# EasyEDA Pro project ProPrj_103-HQU15集成板_Vel2.0.epro, schematic Schematic1

## Sheets
1 核心板外围电路: Board Name: 信号板; Create Date: 2025-02-23; Page Name: 核心板外围电路; Project Name: 103-HQU15集成板-第二版; Schematic Name: Schematic1; Update Date: 2025-02-24; Company: 嘉立创EDA; Page Size: A4; Version: V1.0
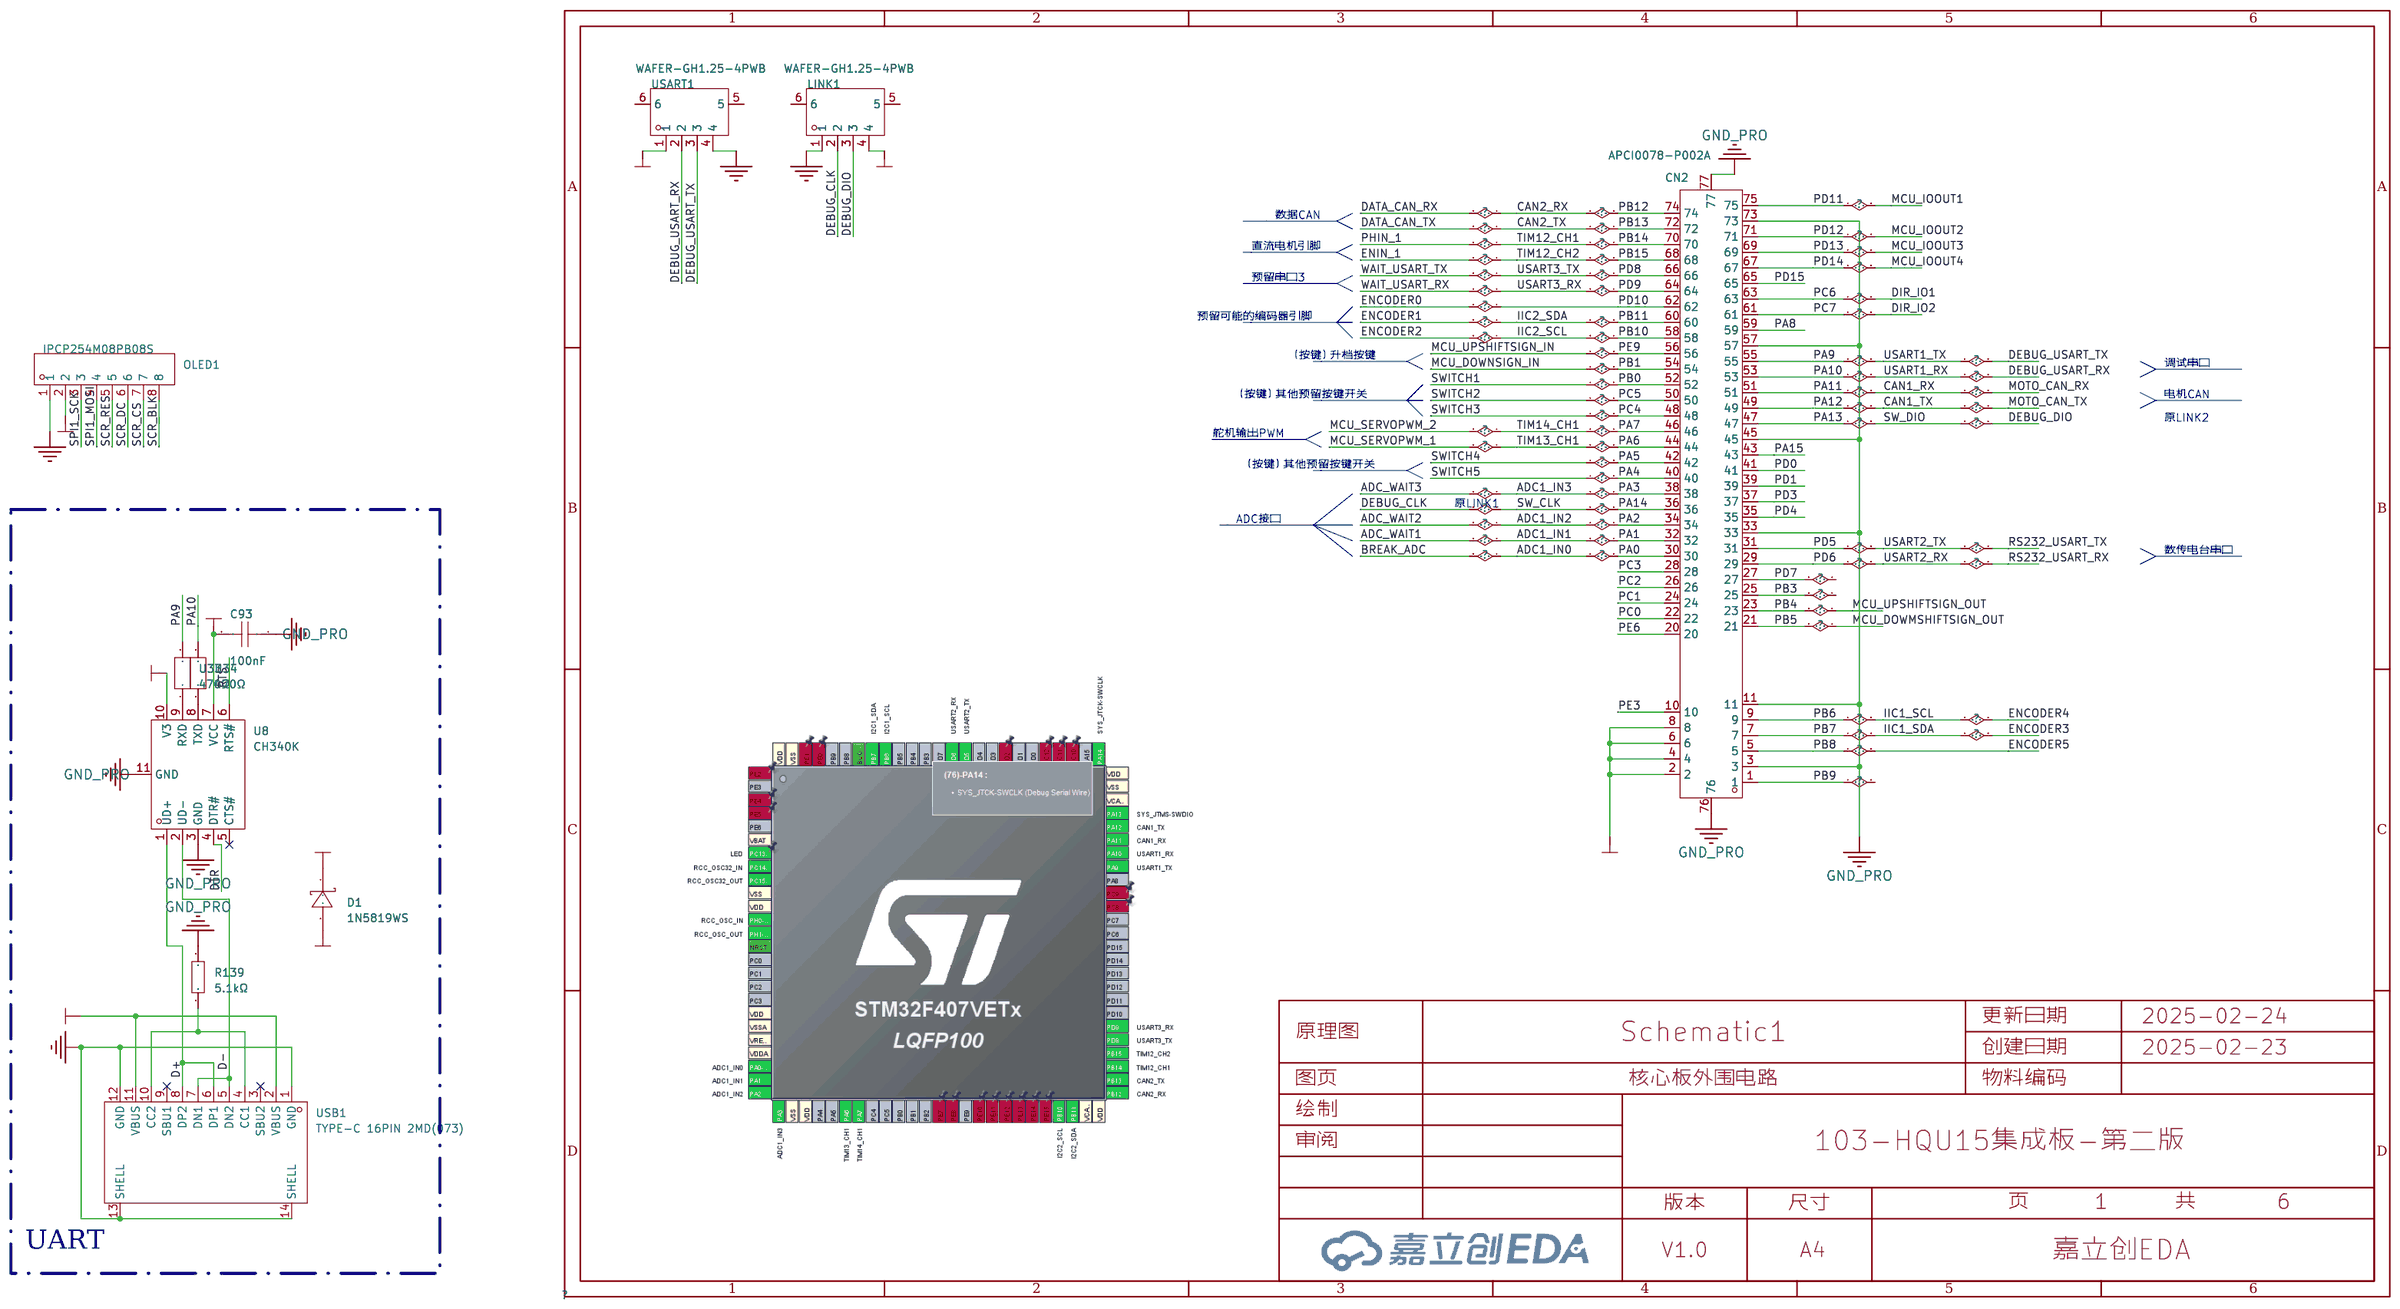
[diagram p0: 核心板外围电路]
2 电源: Page Name: 电源
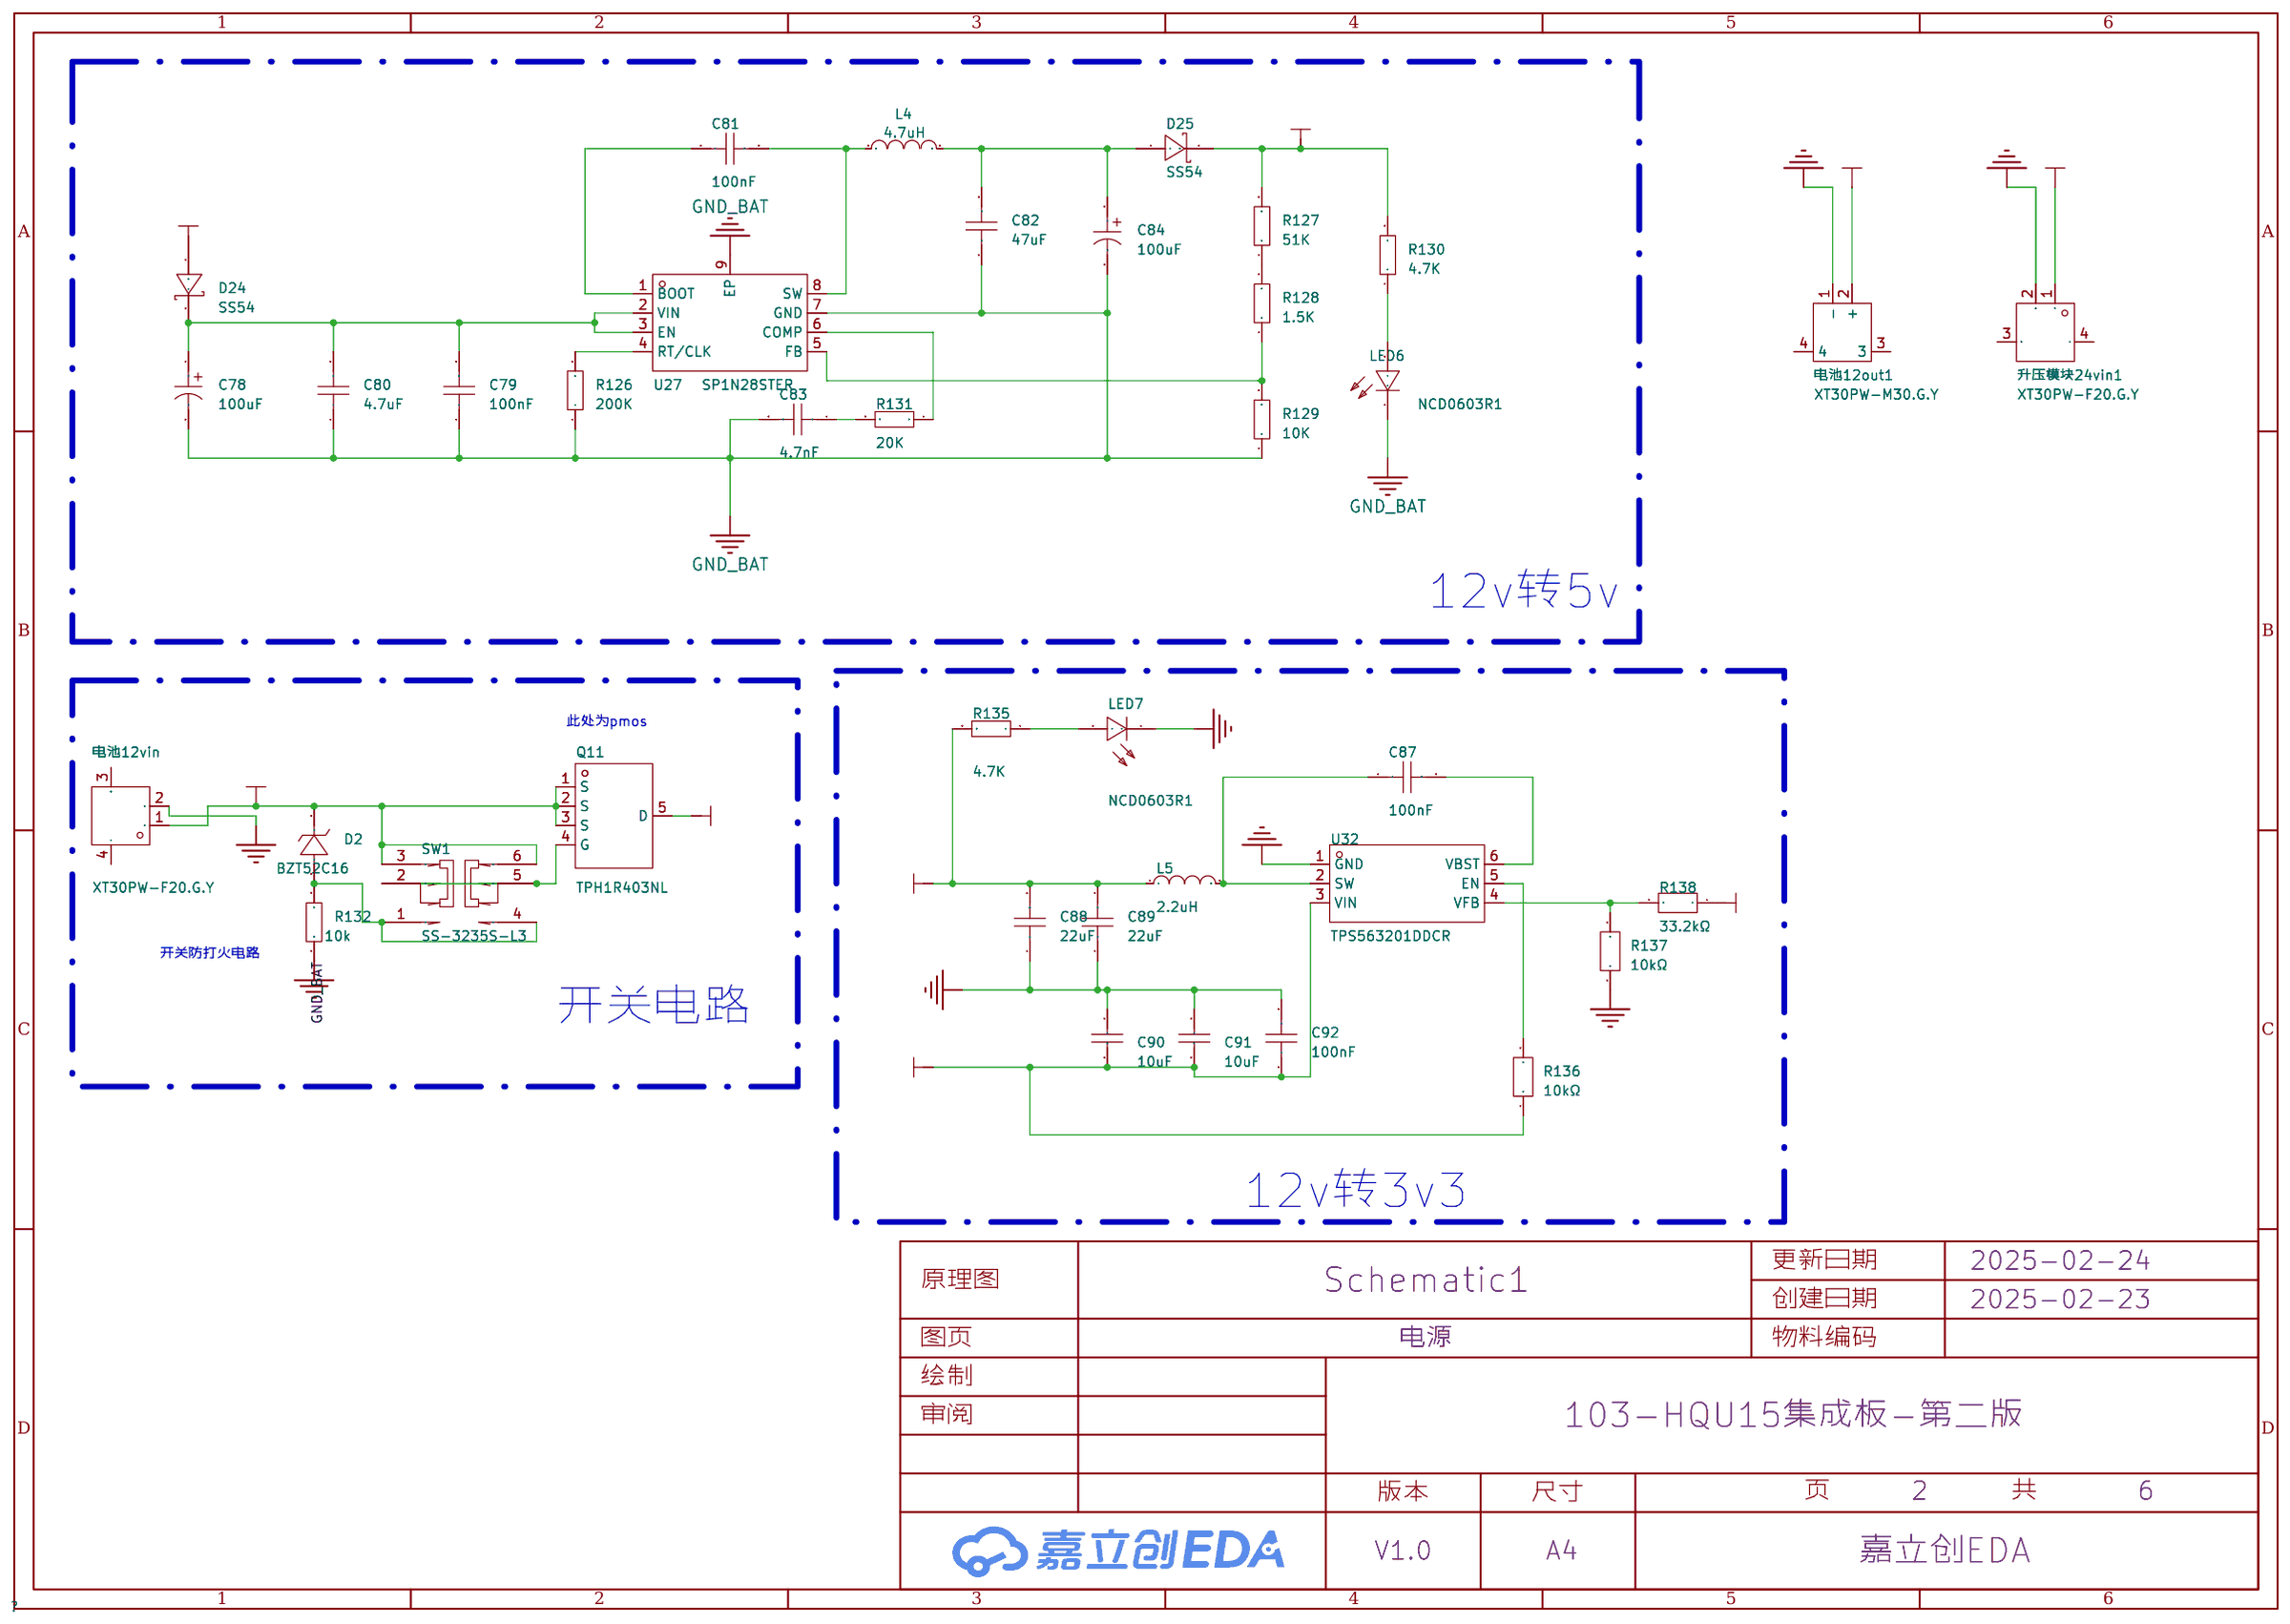
[diagram p1: 电源]
3 保护电路: Page Name: 保护电路
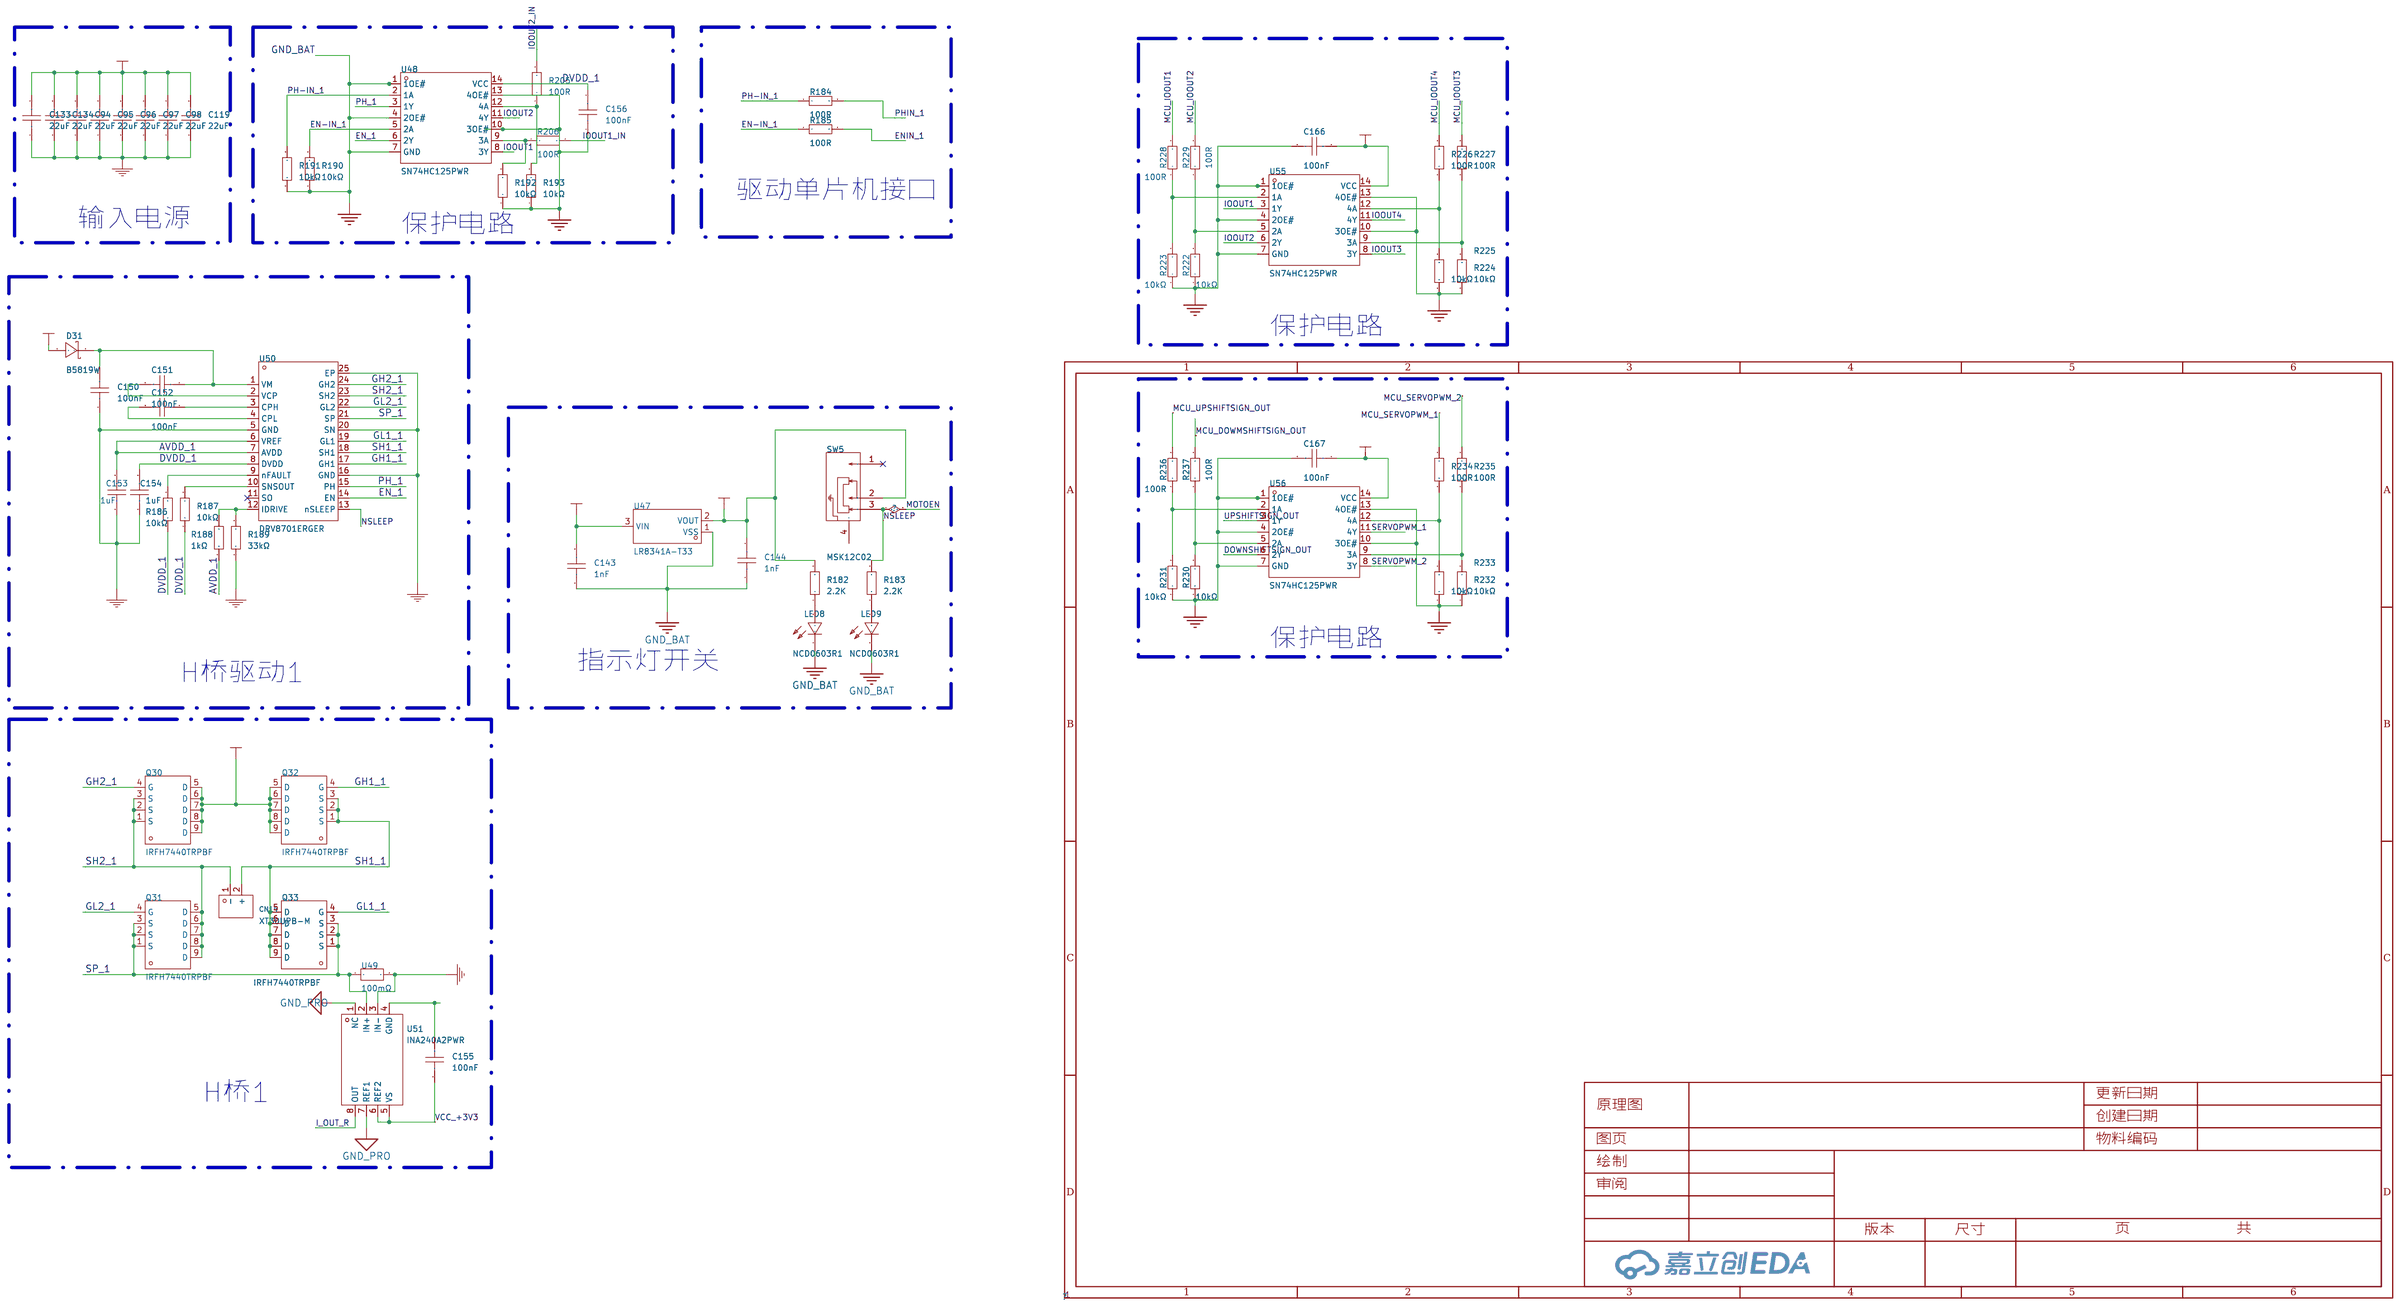
[diagram p2: 保护电路]
4 交互: Page Name: 交互
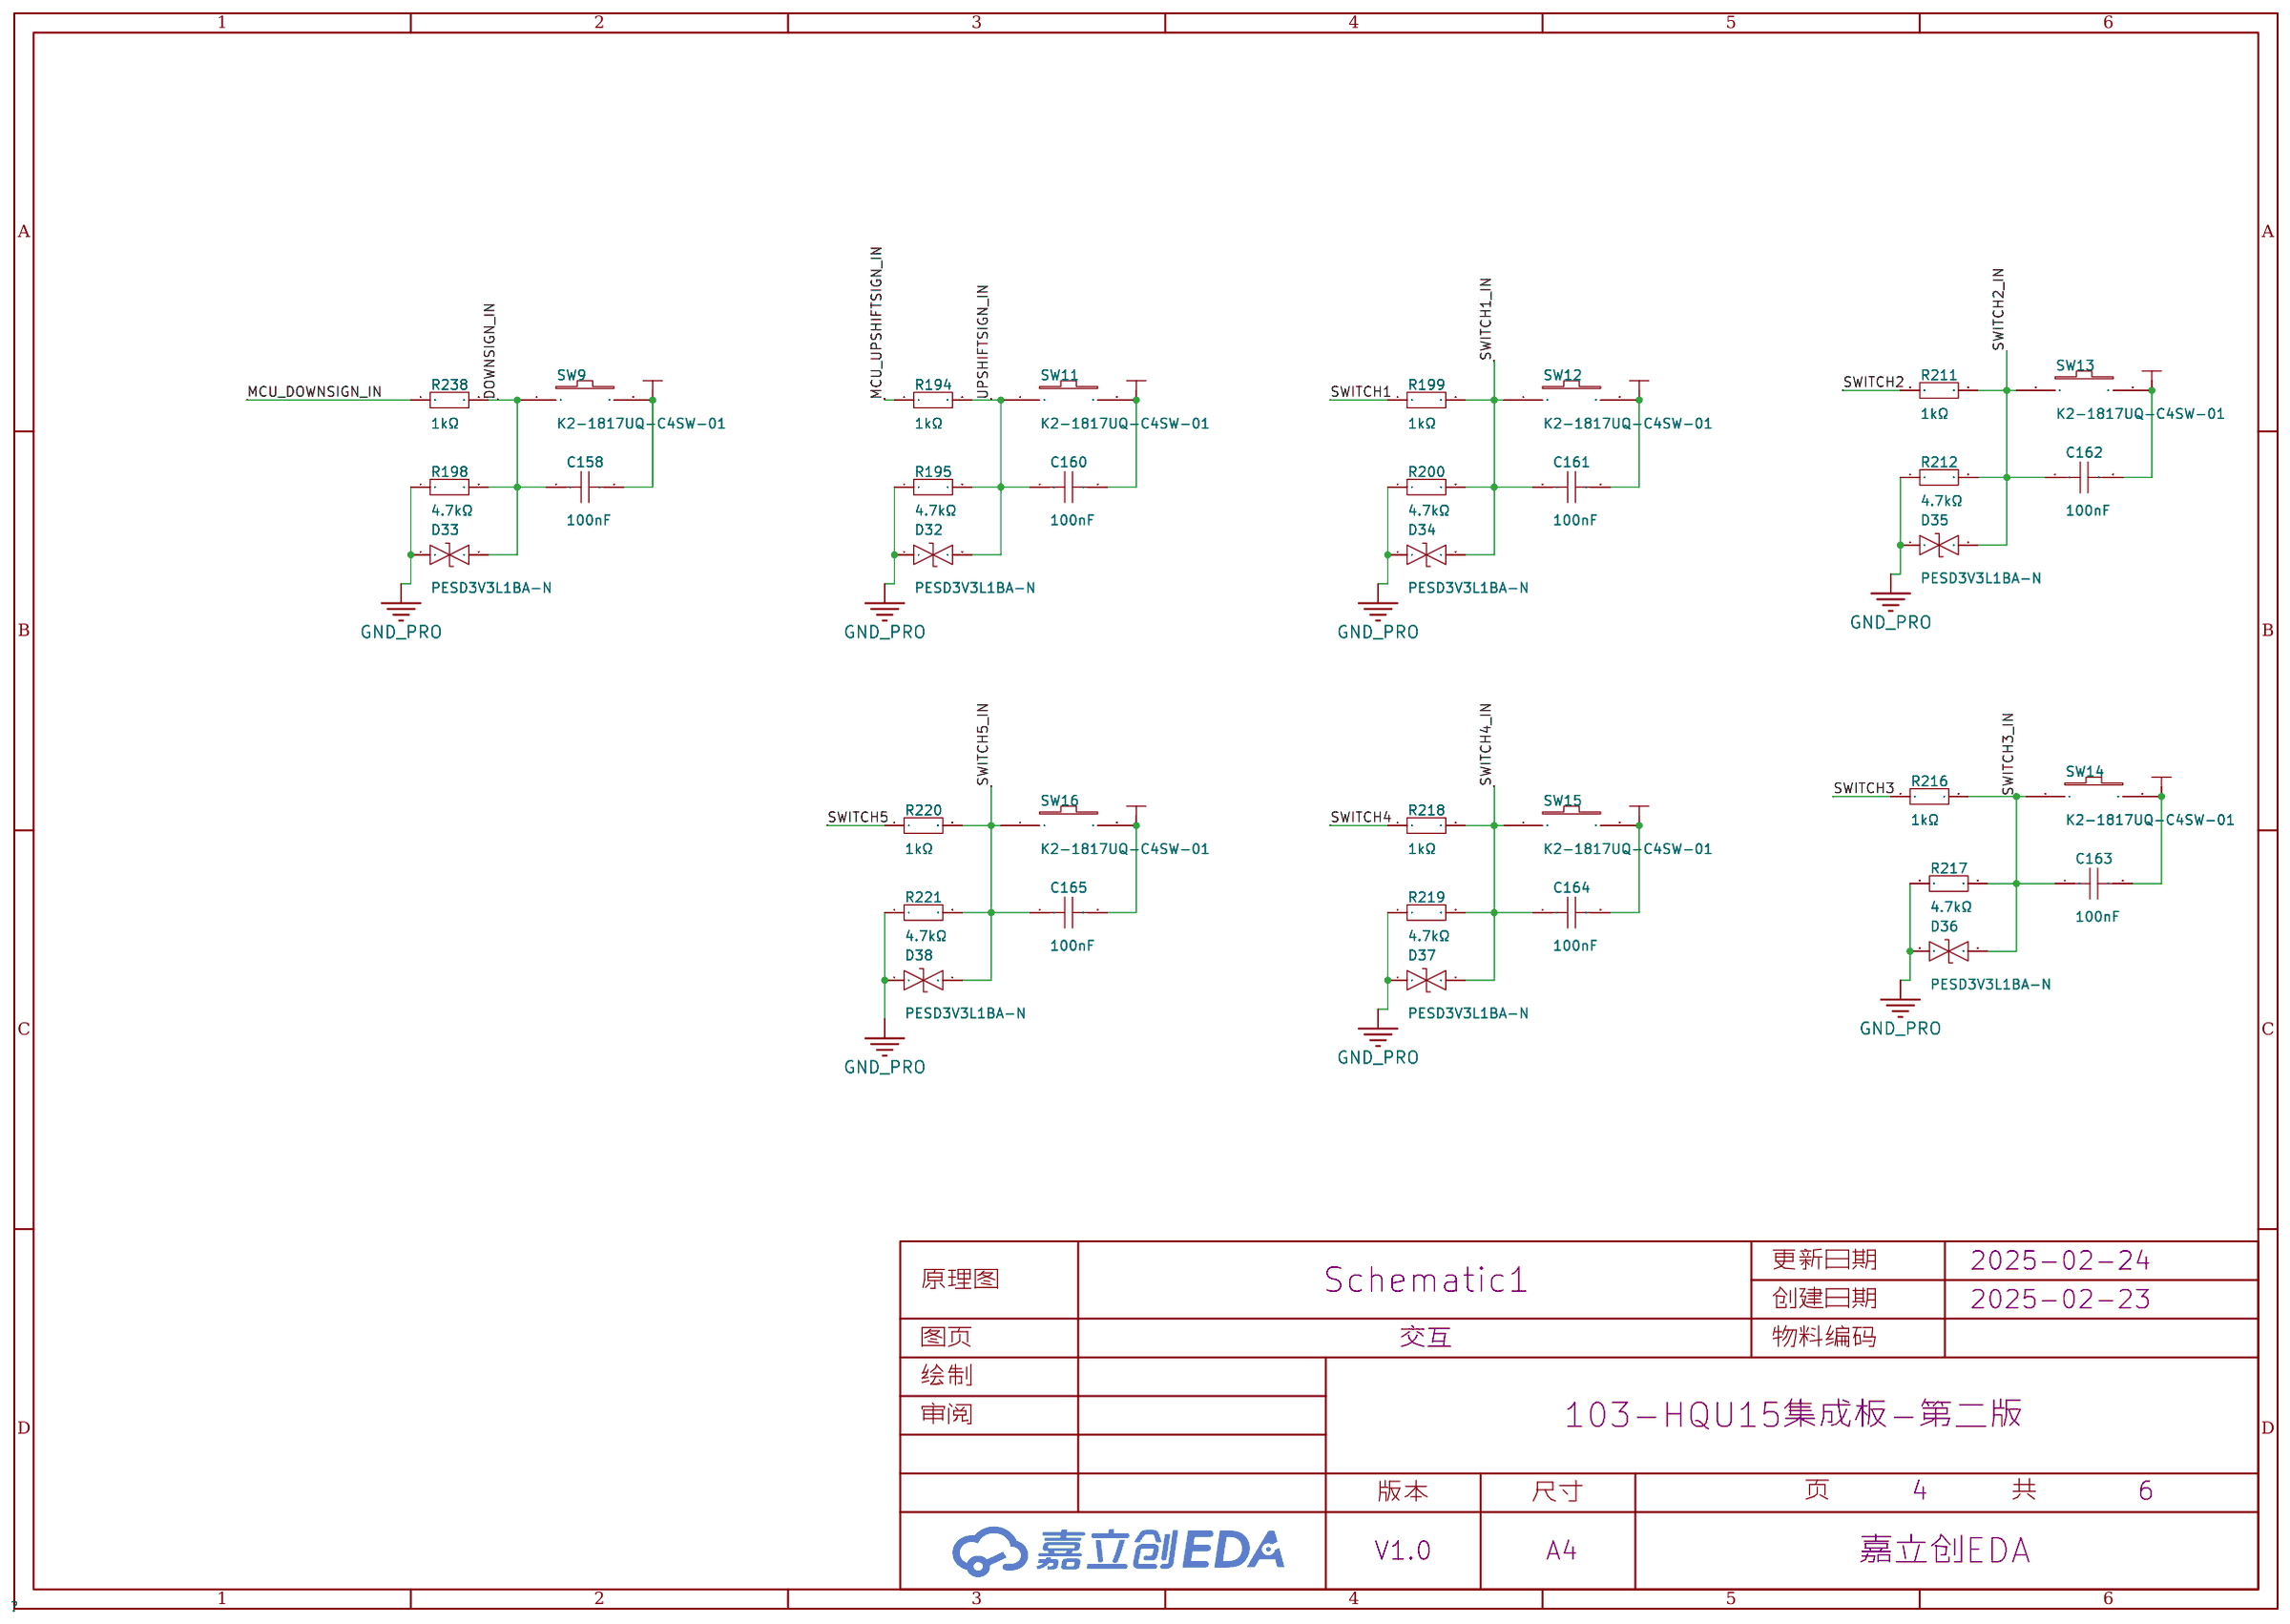
[diagram p3: 交互]
5 无线数传部分: Page Name: 无线数传部分; Update Date: 2025-02-25
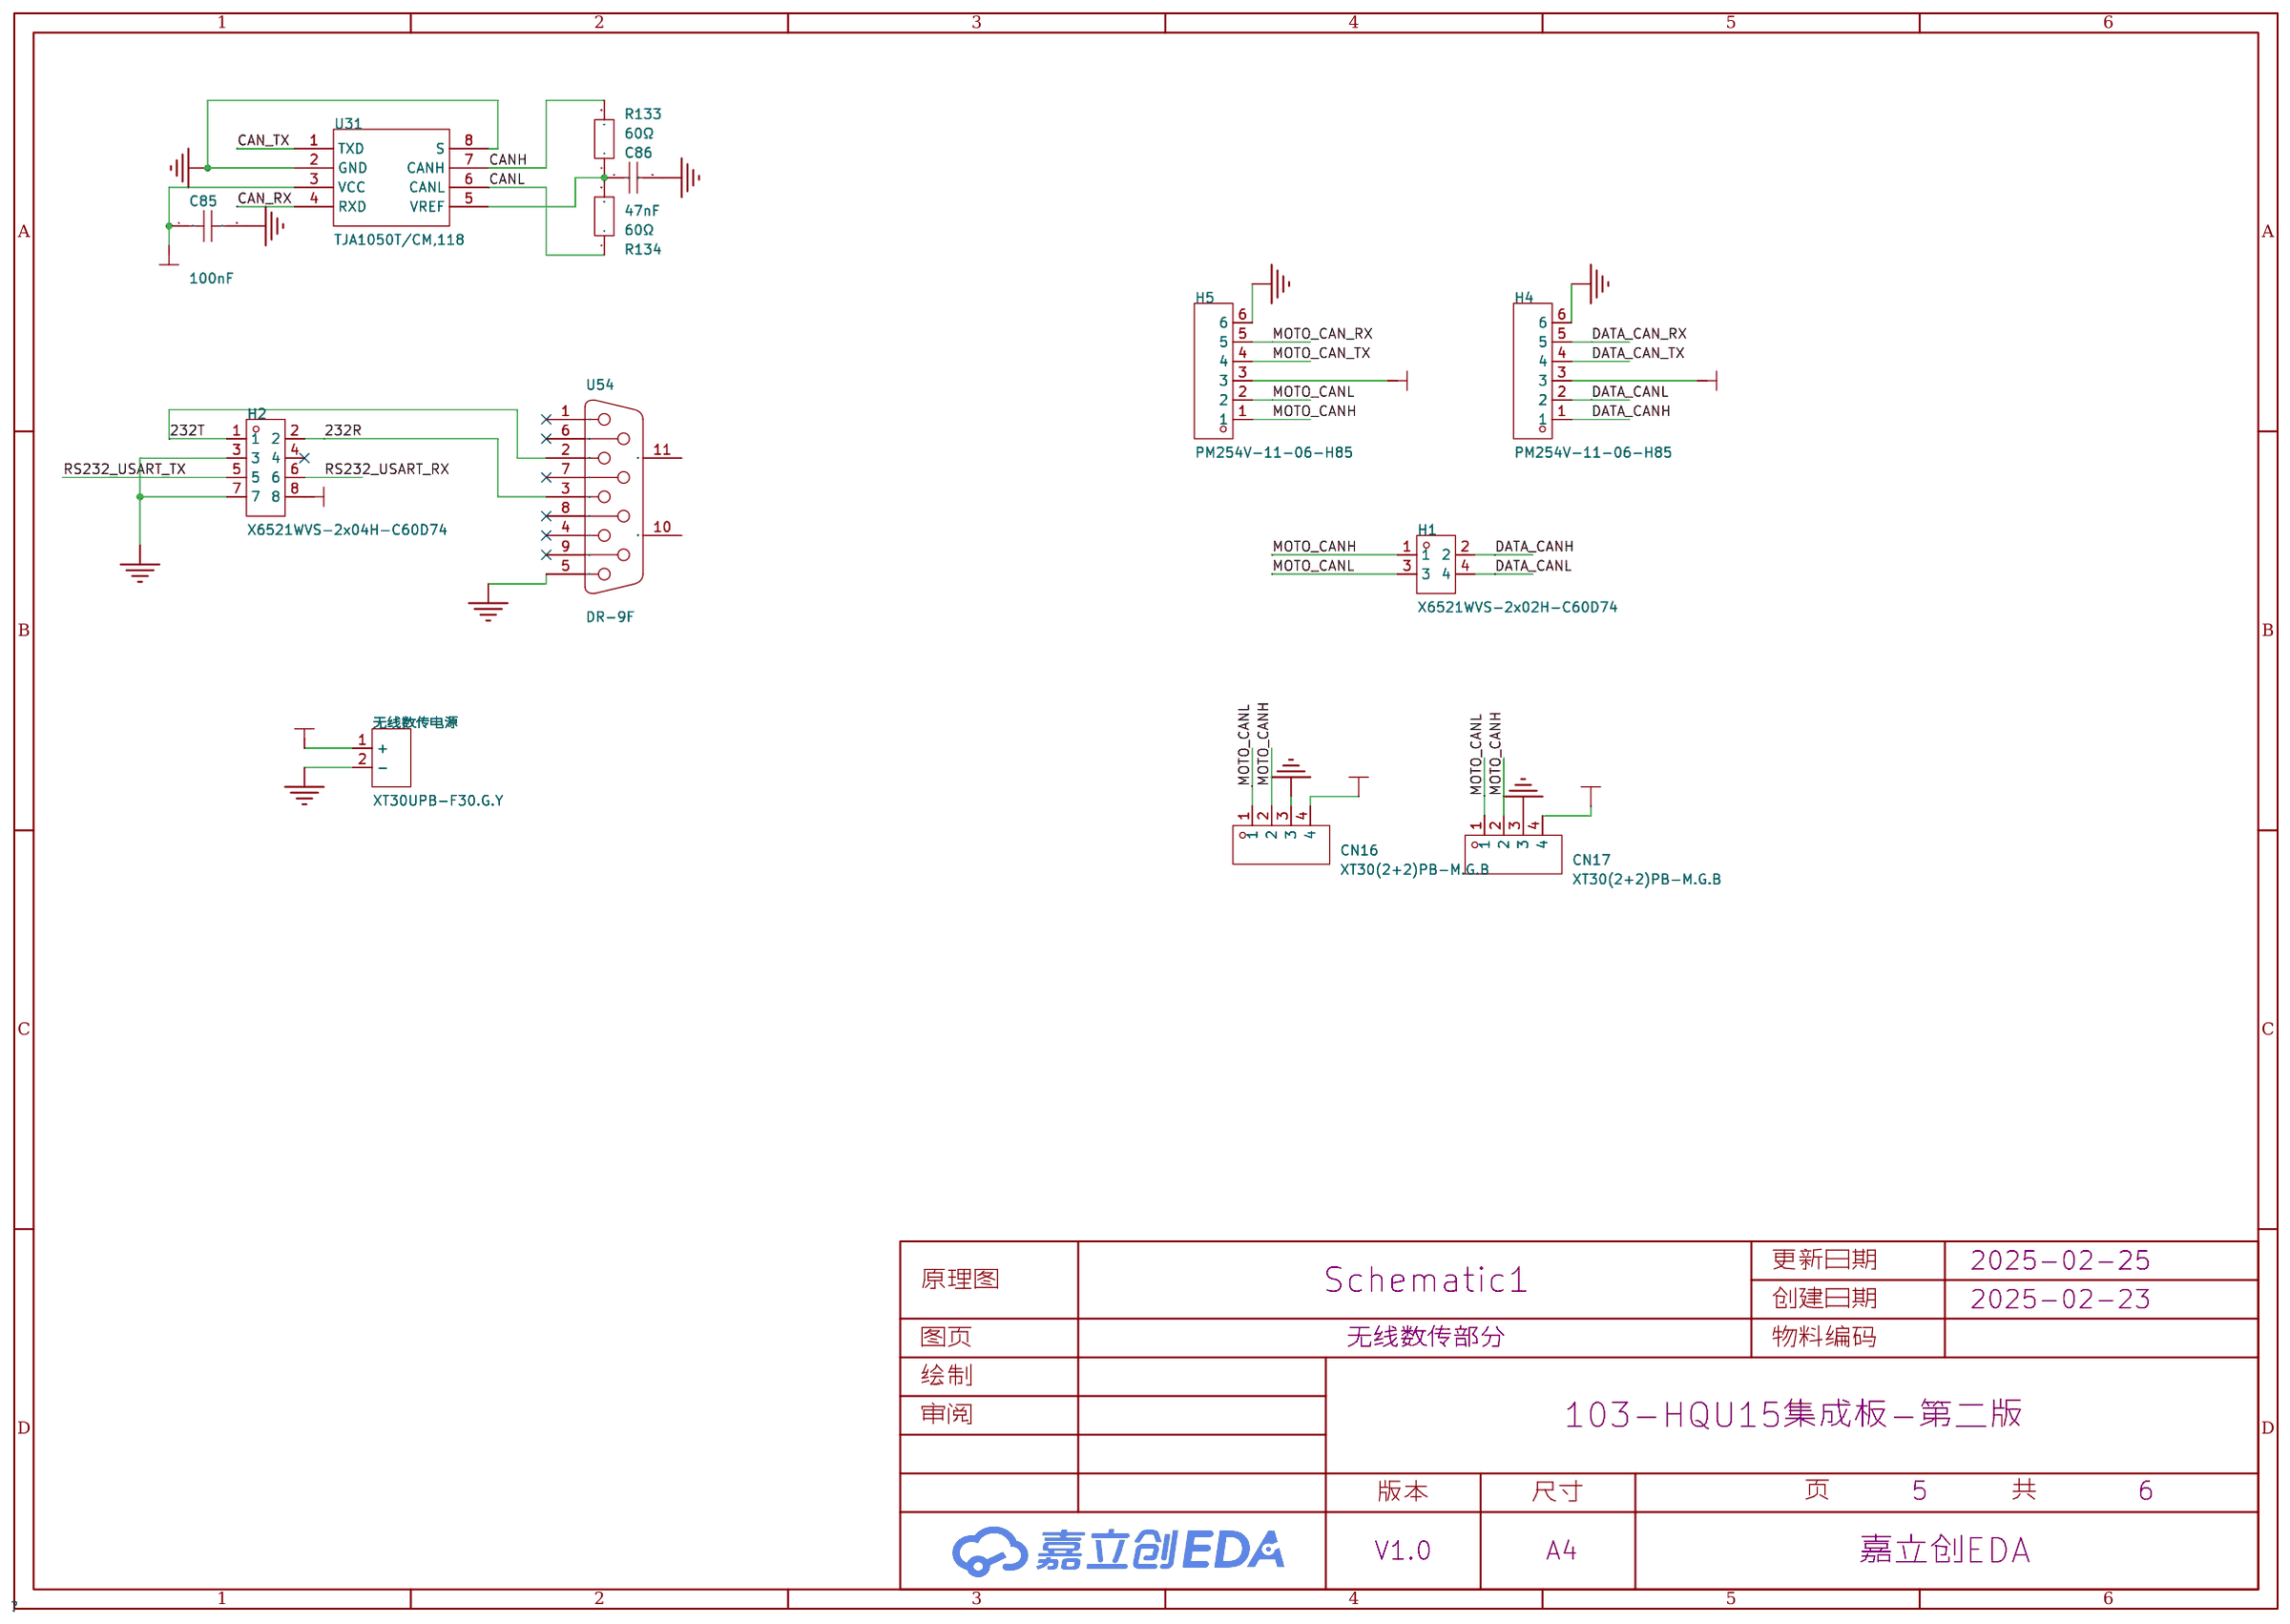
[diagram p4: 无线数传部分]
6 主要接口及其他: Page Name: 主要接口及其他
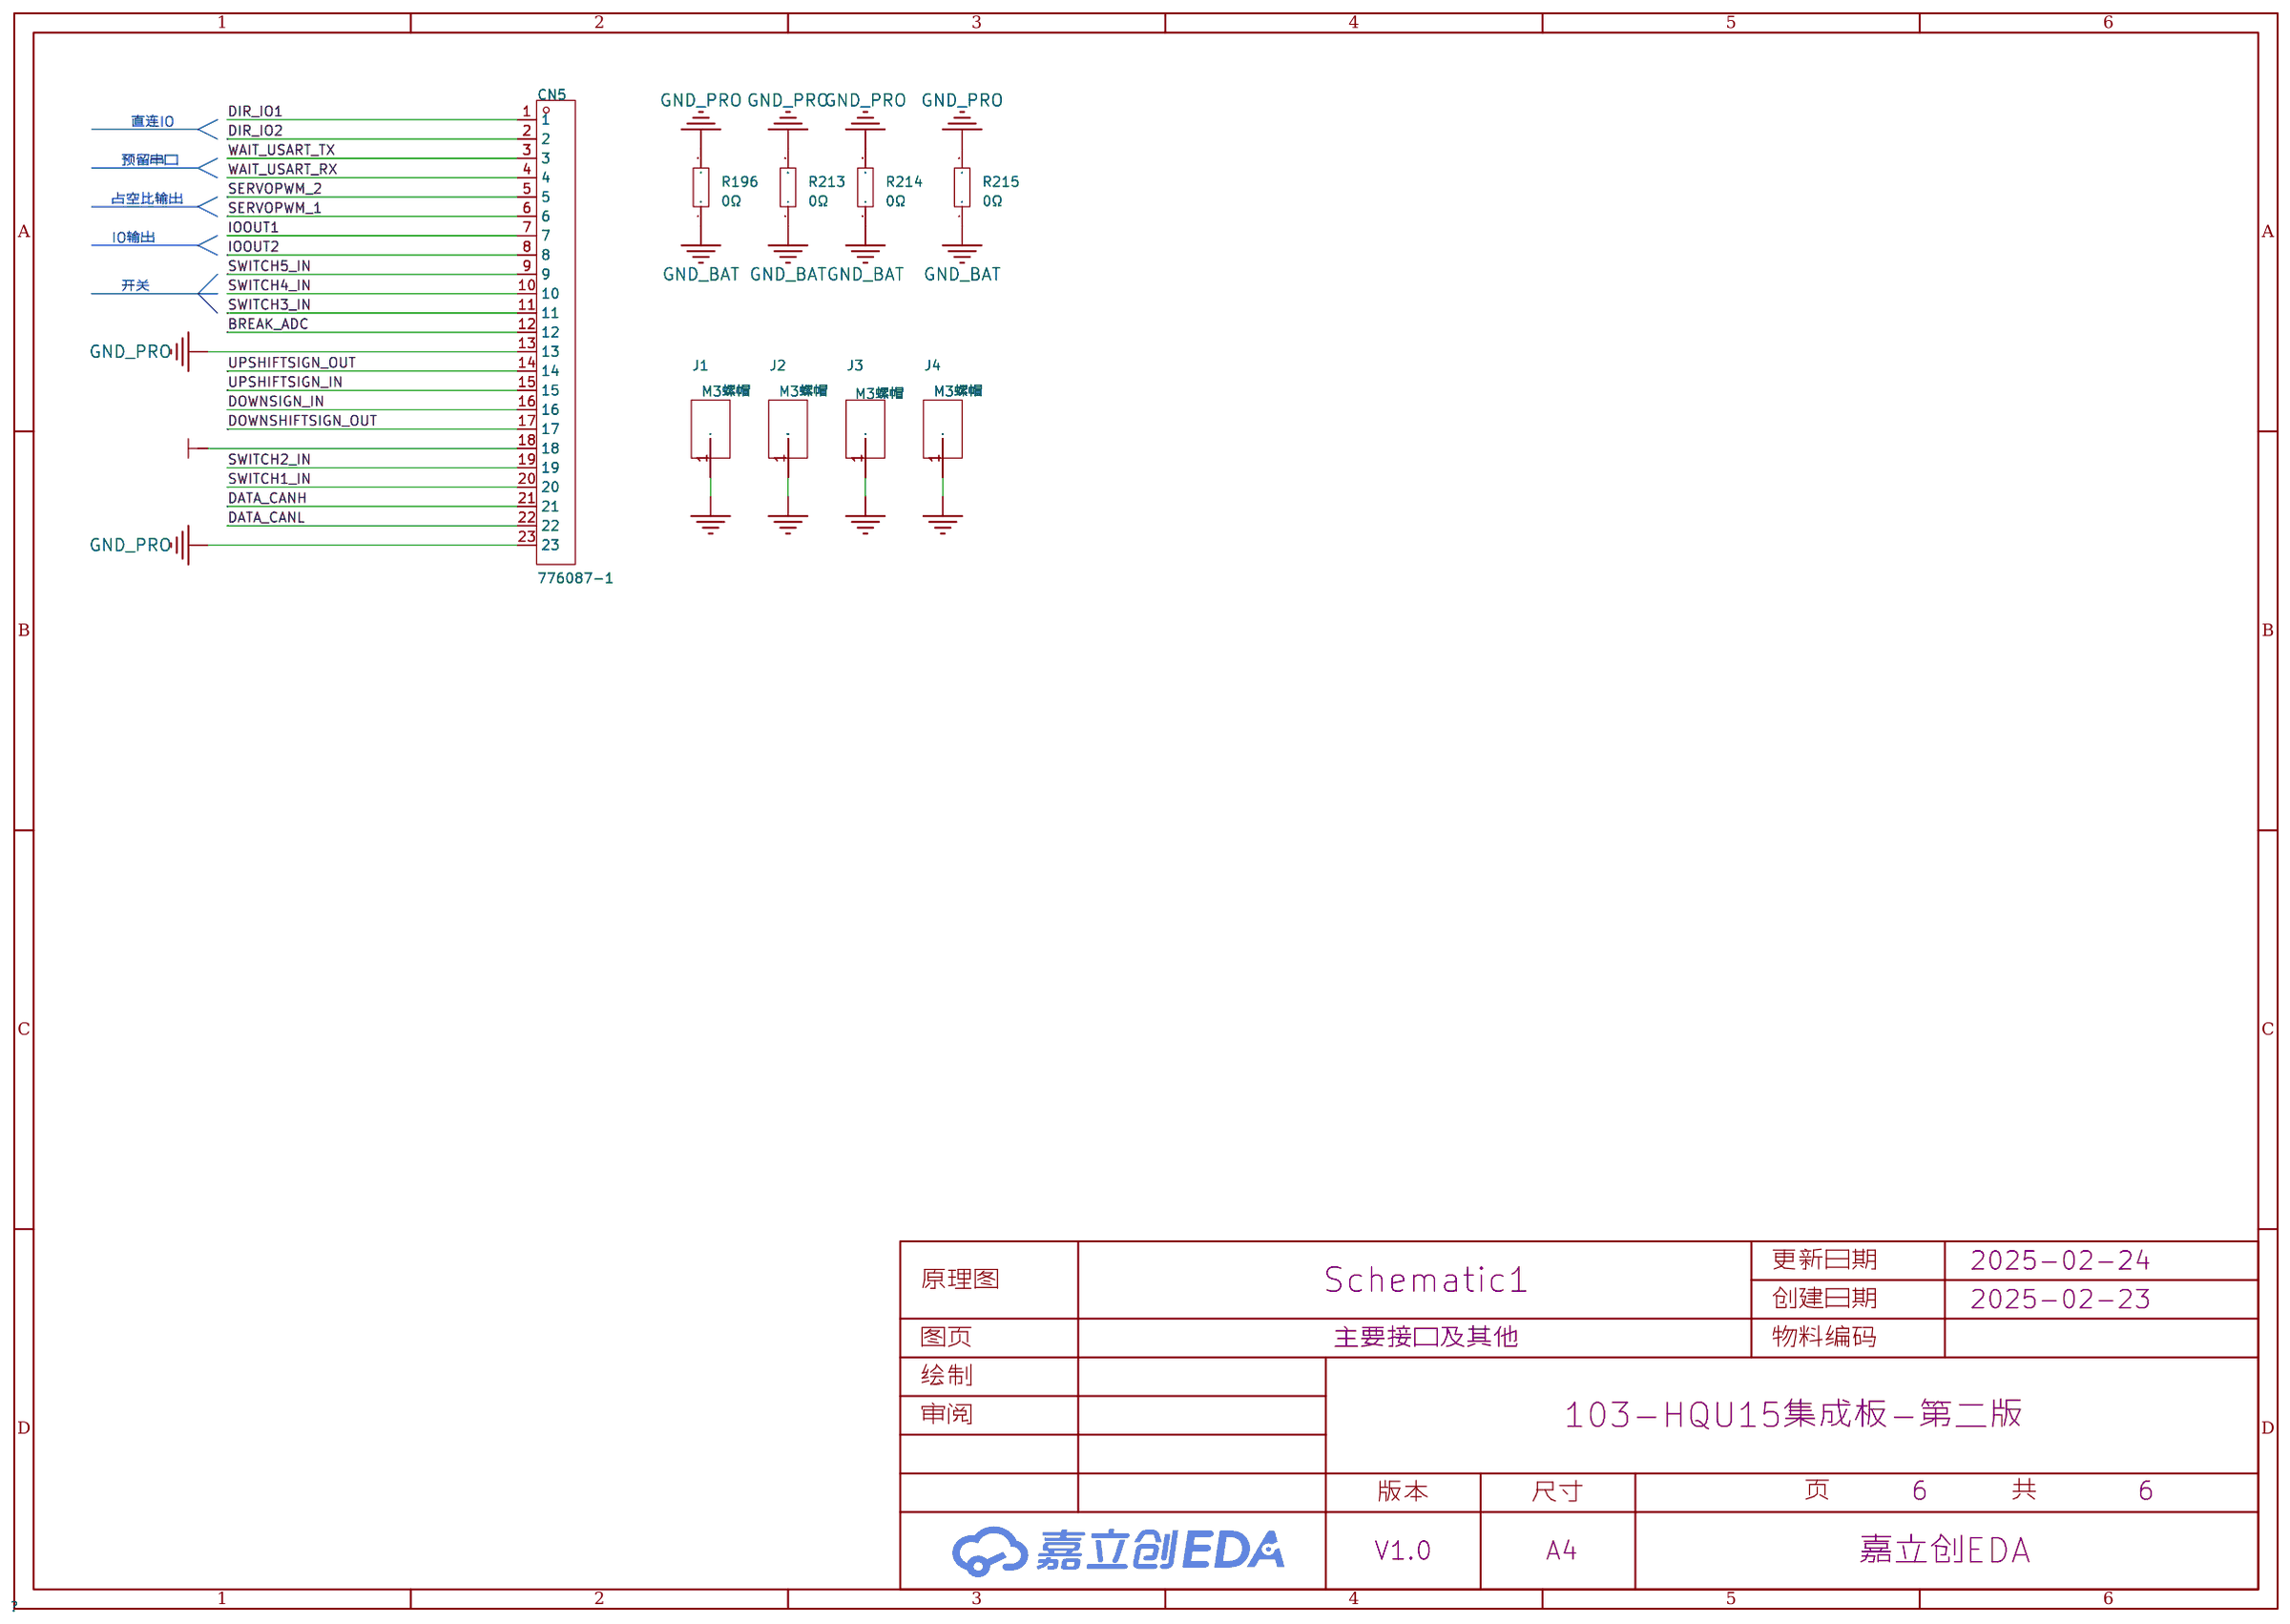
[diagram p5: 主要接口及其他]

## Parts
sheet 主要接口及其他
CN5  776087-1  [CONN-TH_776087-1]
J1  M3螺帽  [M3螺帽]
J2  M3螺帽  [M3螺帽]
J3  M3螺帽  [M3螺帽]
J4  M3螺帽  [M3螺帽]
R196  0Ω  [R0805]
R213  0Ω  [R0805]
R214  0Ω  [R0805]
R215  0Ω  [R0805]
sheet 交互
C158  100nF  [C0603]
C160  100nF  [C0603]
C161  100nF  [C0603]
C162  100nF  [C0603]
C163  100nF  [C0603]
C164  100nF  [C0603]
C165  100nF  [C0603]
D32  PESD3V3L1BA-N  [SOD-323_L1.8-W1.3-LS2.5-BI]
D33  PESD3V3L1BA-N  [SOD-323_L1.8-W1.3-LS2.5-BI]
D34  PESD3V3L1BA-N  [SOD-323_L1.8-W1.3-LS2.5-BI]
D35  PESD3V3L1BA-N  [SOD-323_L1.8-W1.3-LS2.5-BI]
D36  PESD3V3L1BA-N  [SOD-323_L1.8-W1.3-LS2.5-BI]
D37  PESD3V3L1BA-N  [SOD-323_L1.8-W1.3-LS2.5-BI]
D38  PESD3V3L1BA-N  [SOD-323_L1.8-W1.3-LS2.5-BI]
R194  1kΩ  [R0603]
R195  4.7kΩ  [R0603]
R198  4.7kΩ  [R0603]
R199  1kΩ  [R0603]
R200  4.7kΩ  [R0603]
R211  1kΩ  [R0603]
R212  4.7kΩ  [R0603]
R216  1kΩ  [R0603]
R217  4.7kΩ  [R0603]
R218  1kΩ  [R0603]
R219  4.7kΩ  [R0603]
R220  1kΩ  [R0603]
R221  4.7kΩ  [R0603]
R238  1kΩ  [R0603]
SW9  K2-1817UQ-C4SW-01  [KEY-SMD_2P-L6.0-W6.0-P6.00]
SW11  K2-1817UQ-C4SW-01  [KEY-SMD_2P-L6.0-W6.0-P6.00]
SW12  K2-1817UQ-C4SW-01  [KEY-SMD_2P-L6.0-W6.0-P6.00]
SW13  K2-1817UQ-C4SW-01  [KEY-SMD_2P-L6.0-W6.0-P6.00]
SW14  K2-1817UQ-C4SW-01  [KEY-SMD_2P-L6.0-W6.0-P6.00]
SW15  K2-1817UQ-C4SW-01  [KEY-SMD_2P-L6.0-W6.0-P6.00]
SW16  K2-1817UQ-C4SW-01  [KEY-SMD_2P-L6.0-W6.0-P6.00]
sheet 保护电路
C94  22uF  [c1206]
C95  22uF  [c1206]
C96  22uF  [c1206]
C97  22uF  [c1206]
C98  22uF  [c1206]
C119  22uF  [c1206]
C133  22uF  [c1206]
C134  22uF  [c1206]
C143  1nF  [C0603]
C144  1nF  [C0603]
C150  100nF  [C0402]
C151  100nF  [C0402]
C152  100nF  [C0402]
C153  1uF  [C0402]
C154  1uF  [C0402]
C155  100nF  [C0402]
C156  100nF  [C0603]
C166  100nF  [C0603]
C167  100nF  [C0603]
CN14  XT30UPB-M  [CONN-TH_XT30UPB-M]
D31  B5819W  [SOD-123_L2.8-W1.8-LS3.7-RD]
LED8  NCD0603R1  [LED0603-RD_RED]
LED9  NCD0603R1  [LED0603-RD_RED]
Q30  IRFH7440TRPBF  [DFN-8_L5.8-W4.9-P1.27-LS6.0-BL-1]
Q31  IRFH7440TRPBF  [DFN-8_L5.8-W4.9-P1.27-LS6.0-BL-1]
Q32  IRFH7440TRPBF  [DFN-8_L5.8-W4.9-P1.27-LS6.0-BL-1]
Q33  IRFH7440TRPBF  [DFN-8_L5.8-W4.9-P1.27-LS6.0-BL-1]
R182  2.2K  [R0603]
R183  2.2K  [R0603]
R184  100R  [R0603]
R185  100R  [R0603]
R186  10kΩ  [R0402]
R187  10kΩ  [R0402]
R188  1kΩ  [R0402]
R189  33kΩ  [R0402]
R190  10kΩ  [R0603]
R191  10kΩ  [R0603]
R192  10kΩ  [R0603]
R193  10kΩ  [R0603]
R205  100R  [R0603]
R206  100R  [R0603]
R222  10kΩ  [R0603]
R223  10kΩ  [R0603]
R224  10kΩ  [R0603]
R225  10kΩ  [R0603]
R226  100R  [R0603]
R227  100R  [R0603]
R228  100R  [R0603]
R229  100R  [R0603]
R230  10kΩ  [R0603]
R231  10kΩ  [R0603]
R232  10kΩ  [R0603]
R233  10kΩ  [R0603]
R234  100R  [R0603]
R235  100R  [R0603]
R236  100R  [R0603]
R237  100R  [R0603]
SW5  MSK12C02  [SW-TH_MSK12C02]
U47  LR8341A-T33  [SOT-23-3L_L2.9-W1.6-P1.90-LS2.8-BL]
U48  SN74HC125PWR  [TSSOP-14_L5.0-W4.4-P0.65-LS6.5-BL]
U49  100mΩ  [R1206]
U50  DRV8701ERGER  [VQFN-24_L4.0-W4.0-P0.50-BL-EP2.5]
U51  INA240A2PWR  [TSSOP-8_L4.4-W3.0-P0.65-LS6.4-BL]
U55  SN74HC125PWR  [TSSOP-14_L5.0-W4.4-P0.65-LS6.5-BL]
U56  SN74HC125PWR  [TSSOP-14_L5.0-W4.4-P0.65-LS6.5-BL]
sheet 无线数传部分
C85  100nF  [C0603]
C86  47nF  [C0603]
CN16  XT30(2+2)PB-M.G.B  [CONN-TH_XT30PB-M]
CN17  XT30(2+2)PB-M.G.B  [CONN-TH_XT30PB-M]
H1  X6521WVS-2x02H-C60D74  [hdr-smd_4p-p2.54-v-m-r2-c5-s7.4]
H2  X6521WVS-2x04H-C60D74  [HDR-SMD_8P-P2.54-V-M-R2-C5-S7.4]
H4  PM254V-11-06-H85  [HDR-TH_6P-P2.54-V-F]
H5  PM254V-11-06-H85  [HDR-TH_6P-P2.54-V-F]
R133  60Ω  [R0603]
R134  60Ω  [R0603]
U31  TJA1050T/CM,118  [soic-8_l5.0-w4.0-p1.27-ls6.0-bl]
U54  DR-9F  [DR9-TH_ZHOUR_DR-9P-L]
无线数传电源  XT30UPB-F30.G.Y  [CONN-TH_XT30UPB-F]
sheet 核心板外围电路
C93  100nF  [C0603]
CN2  APCI0078-P002A  [NGFF-SMD-BKEY 5+6(2235))]
D1  1N5819WS  [SOD-323_L1.8-W1.3-LS2.5-RD]
LINK1  WAFER-GH1.25-4PWB  [CONN-SMD_4P-P1.25_XUNPU_WAFER-GH1.25-4PWB]
OLED1  IPCP254M08PB08S  [HDR-SMD_8P-P2.54-V-M-S4.8]
R139  5.1kΩ  [R0603]
U8  CH340K  [ESOP-10_L4.9-W3.9-P1.00-LS6.0-BL-EP]
U33  470Ω  [R0603]
U34  470Ω  [R0603]
USART1  WAFER-GH1.25-4PWB  [CONN-SMD_4P-P1.25_XUNPU_WAFER-GH1.25-4PWB]
USB1  TYPE-C 16PIN 2MD(073)  [USB-C-SMD_TYPE-C-6PIN-2MD-073]
sheet 电源
C78  100uF  [CAP-SMD_BD6.3-L6.6-W6.6-LS7.4-FD]
C79  100nF  [C0603]
C80  4.7uF  [c1206]
C81  100nF  [C0603]
C82  47uF  [c1206]
C83  4.7nF  [C0603]
C84  100uF  [CAP-SMD_BD6.3-L6.6-W6.6-LS7.4-FD]
C87  100nF  [C0603]
C88  22uF  [C0805]
C89  22uF  [C0805]
C90  10uF  [C0805]
C91  10uF  [C0805]
C92  100nF  [C0603]
D2  BZT52C16  [SOD-123_L2.7-W1.7-LS3.8-RD]
D24  SS54  [SMA_L4.4-W2.8-LS5.4-R-RD]
D25  SS54  [SMA_L4.4-W2.8-LS5.4-R-RD]
L4  4.7uH  [IND-SMD_L7.8-W7.0_MAPM0630F]
L5  2.2uH  [IND-SMD_L2.5-W2.0_MHCHL2520]
LED6  NCD0603R1  [LED0603-RD_RED]
LED7  NCD0603R1  [LED0603-RD_RED]
Q11  TPH1R403NL  [POWERVDFN-8_L6.2-W5.2-P1.27-LS6.0-BL]
R126  200K  [R0603]
R127  51K  [R0603]
R128  1.5K  [R0603]
R129  10K  [R0603]
R130  4.7K  [R0603]
R131  20K  [R0603]
R132  10K  [R0603]
R135  4.7K  [R0603]
R136  10kΩ  [R0603]
R137  10kΩ  [R0603]
R138  33.2kΩ  [R0603]
SW1  SS-3235S-L3  [SW-SMD_SS-3235S-L3.00]
U27  SP1N28STER  [ESOP-8_L4.9-W3.9-P1.27-LS6.0-BL-EP3.1]
U32  TPS563201DDCR  [SOT-23-6_L2.9-W1.6-P0.95-LS2.8-BR]
升压模块24vin1  XT30PW-F20.G.Y  [CONN-TH_XT30PW-F-1]
电池12out1  XT30PW-M30.G.Y  [CONN-TH_XT30PW-M]
电池12vin  XT30PW-F20.G.Y  [CONN-TH_XT30PW-F-1]

## Library data of the parts
CN5 = 776087-1: 插针结构:-;间距:4mm;安装方式:-;参考系列:-;排数:3;每排PIN数:-;行距:4mm;触头材质:黄铜;工作温度范围:-40℃~+105℃;; LCSC Part Name: 间距:4mm; Supplier Part: C378893; Manufacturer: TE Connectivity(泰科电子); Supplier Footprint: P=4mm; JLCPCB Part Class: 扩展库; Datasheet: https://atta.szlcsc.com/upload/public/pdf/source/20190816/C378893_2EC057ACC9A4FFD8A2048AA2275DEB43.pdf; Supplier: LCSC; Pitch: 4mm; Number of Rows: 3; Row Spacing: 4mm; Contact Material: 黄铜; Operating Temperature Range: -40℃~+105℃
J1-J4 = M3螺帽
R196 R213-R215 = 0805W8F0000T5E: 电阻类型:厚膜电阻;阻值:0Ω;精度:±1%;功率:125mW;最大工作电压:150V;温度系数:±800ppm/℃;; LCSC Part Name: 0Ω ±1% 125mW 厚膜电阻; Supplier Part: C17477; Manufacturer: UNI-ROYAL(厚声); Supplier Footprint: 0805; JLCPCB Part Class: 基础库; Datasheet: https://atta.szlcsc.com/upload/public/pdf/source/20200306/C422600_1E6D84923E4A46A82E41ADD87F860B5C.pdf; Supplier: LCSC; Type: 厚膜电阻; Tolerance: ±1%; Power(Watts): 125mW; Overload Voltage (Max): 150V; Temperature Coefficient: ±800ppm/℃; Operating Temperature Range: -55℃~+155℃
C85 C87 C92 C93 C156 C158 C160-C167 = CGA0603X7R104K500JT: 容值:100nF;精度:±10%;额定电压:50V;材质(温度系数):X7R;; LCSC Part Name: 100nF ±10% 50V; Supplier Part: C6119867; Manufacturer: HRE(芯声); Supplier Footprint: 0603; JLCPCB Part Class: 扩展库; Supplier: LCSC; Tolerance: ±10%; Voltage Rated: 50V; Temperature Coefficient: X7R
D32-D38 = PESD3V3L1BA-N: SOD-323/0805 功率350W VBWM=3.3V 双向 空气30KA 接触30KA; Supplier Part: C316020; Manufacturer: BORN(伯恩半导体); Supplier Footprint: SOD-323; JLCPCB Part Class: 扩展库; Datasheet: https://atta.szlcsc.com/upload/public/pdf/source/20181025/C316020_2B145715011D530A3B5DDCE0F9684BA2.pdf; Supplier: LCSC; Type: ESD
R194 R199 R211 R216 R218 R220 R238 = 0603WAF1001T5E: 电阻类型:厚膜电阻;阻值:1kΩ;精度:±1%;功率:100mW;最大工作电压:75V;温度系数:±100ppm/℃;; LCSC Part Name: 1kΩ ±1% 100mW 厚膜电阻; Supplier Part: C21190; Manufacturer: UNI-ROYAL(厚声); Supplier Footprint: 0603; JLCPCB Part Class: 基础库; Datasheet: https://atta.szlcsc.com/upload/public/pdf/source/20200306/C422600_1E6D84923E4A46A82E41ADD87F860B5C.pdf; Supplier: LCSC; Type: 厚膜电阻; Tolerance: ±1%; Power(Watts): 100mW; Overload Voltage (Max): 75V; Temperature Coefficient: ±100ppm/℃; Operating Temperature Range: -55℃~+155℃
R195 R198 R200 R212 R217 R219 R221 = 0603WAF4701T5E: 电阻类型:厚膜电阻;阻值:4.7kΩ;精度:±1%;功率:100mW;最大工作电压:75V;温度系数:±100ppm/℃;; LCSC Part Name: 4.7kΩ ±1% 100mW 厚膜电阻; Supplier Part: C23162; Manufacturer: UNI-ROYAL(厚声); Supplier Footprint: 0603; JLCPCB Part Class: 基础库; Datasheet: https://atta.szlcsc.com/upload/public/pdf/source/20200306/C422600_1E6D84923E4A46A82E41ADD87F860B5C.pdf; Supplier: LCSC; Type: 厚膜电阻; Tolerance: ±1%; Power(Watts): 100mW; Overload Voltage (Max): 75V; Temperature Coefficient: ±100ppm/℃; Operating Temperature Range: -55℃~+155℃
SW9 SW11-SW16 = K2-1817UQ-C4SW-01: 电路结构:单刀单掷;按钮形状:圆形按钮;作用力:250gf;安装方式:立贴;开关长度:6mm;开关宽度:6mm;开关高度:5mm;触点电流:50mA;额定电压(DC):12V;绝缘电阻:100MΩ;带灯:-;机械寿命:10万次;; LCSC Part Name: 无声开关 6.0mm*6.0mm*5mm  250G; Supplier Part: C128939; Manufacturer: 韩国韩荣; Supplier Footprint: SMD; JLCPCB Part Class: 扩展库; Datasheet: https://atta.szlcsc.com/upload/public/pdf/source/20210322/C2690010_58F7DD7E136B4BFA712F0D44F3FEADD9.pdf; Supplier: LCSC; Circuit: 单刀单掷; Actuator Style: 圆形按钮; Operating Force: 250gf; Mounting Style: 立贴; Switch Length: 6mm; Switch Width: 6mm; Switch Height: 5mm; Contact Current: 50mA; Voltage Rating (DC): 12V; Insulation Resistance: 100MΩ; Mechanical Life: 10万次; Operating Temperature: -25℃~+85℃
C94-C98 C119 C133 C134 = CGA1206X5R226M350NT: 容值:22uF;精度:±20%;额定电压:35V;材质(温度系数):X5R;; LCSC Part Name: 22uF ±20% 35V; Supplier Part: C6119969; Manufacturer: HRE(芯声); Supplier Footprint: 1206; JLCPCB Part Class: 扩展库; Supplier: LCSC; Tolerance: ±20%; Voltage Rated: 35V; Temperature Coefficient: X5R
C79-C83 C143 C144 = CAP_0603: Supplier Footprint: 0603
C150-C152 C155 = CL05B104KB54PNC: 容值:100nF;精度:±10%;额定电压:50V;材质(温度系数):X7R;; LCSC Part Name: 100nF ±10% 50V; Supplier Part: C307331; Manufacturer: SAMSUNG(三星); Supplier Footprint: 0402; JLCPCB Part Class: 基础库; Datasheet: https://atta.szlcsc.com/upload/public/pdf/source/20160218/1457707763339.pdf; Supplier: LCSC; Tolerance: ±10%; Voltage Rated: 50V; Temperature Coefficient: X7R
C153 C154 = GRM155R61H105KE05D: 容值:1uF;精度:±10%;额定电压:50V;材质(温度系数):X5R;; LCSC Part Name: 1uF ±10% 50V; Supplier Part: C1518208; Manufacturer: muRata(村田); Supplier Footprint: 0402; JLCPCB Part Class: 扩展库; Datasheet: https://atta.szlcsc.com/upload/public/pdf/source/20210607/3F03D47137F6EC7729AB4067EB2A6EB3.pdf; Supplier: LCSC; Tolerance: ±10%; Voltage Rated: 50V; Temperature Coefficient: X5R
CN14 = XT30UPB-M: 类别:-;类型1:-;; LCSC Part Name: AMASS(艾迈斯)板载立式 航模锂电池控制器连接器插头 公头XT30UPB-M; Supplier Part: C428721; Manufacturer: AMASS(艾迈斯); JLCPCB Part Class: 扩展库; Datasheet: https://atta.szlcsc.com/upload/public/pdf/source/20230412/7B5DFEF57C9EA5273853390C734B3AC5.pdf; Supplier: LCSC; Brand: 艾迈斯; Type: 航模插头; Colour: 黄色; RatedVoltage: DC 500V; InterfaceType: 公头; MetalMaterial: 镀金; InsulationMaterial: PA; RatedCurrent: 15A; contact resistance: 0.65mΩ
D31 = B5819W_C64885: 二极管配置:独立式;正向压降(Vf):900mV@3A;直流反向耐压(Vr):40V;整流电流:1A;; LCSC Part Name: 电压:40V 电流:1A; Supplier Part: C64885; Manufacturer: MDD(辰达半导体); Supplier Footprint: SOD-123; JLCPCB Part Class: 扩展库; Datasheet: https://atta.szlcsc.com/upload/public/pdf/source/20230823/08094EB15E96CCD3558B35DDD25E45C2.pdf; Supplier: LCSC; Diode Configuration: 独立式; Forward Voltage (Vf@If): 900mV@3A; Reverse Voltage (Vr): 40V; Rectified Current: 1A; Reverse Leakage Current (Ir): 1mA@40V
LED6-LED9 = NCD0603R1_C84263: 灯头类型:-;发光颜色:红色;正向电压(VF):1.6V~2.6V;功率:65mW;正向电流:20mA;主波长:615nm~630nm;二极管配置:独立二极管;透镜颜色:无色透明透镜;色温:-;发光强度:80mcd~220mcd;发光角度:130°;载带方式:-;工作温度:-30℃~+85℃;; Supplier Part: C84263; Manufacturer: 国星光电; Supplier Footprint: 0603; JLCPCB Part Class: 扩展库; Datasheet: https://atta.szlcsc.com/upload/public/pdf/source/20200820/C84263_DABC6A75E58F576973B407FDBA283D60.pdf; Supplier: LCSC; Emitted Color: 红色; Forward Voltage (VF): 1.6V~2.6V; Power Dissipation: 65mW; Forward Current: 20mA; Dominant Wavelength: 615nm~630nm; Diode Configuration: 独立二极管; Lens Color: 无色透明透镜; Luminous Intensity: 80mcd~220mcd; Viewing Angle: 130°; Operating Temperature: -30℃~+85℃
Q30-Q33 = IRFH7440TRPBF: 类型:N沟道;漏源电压(Vdss):40V;连续漏极电流(Id):85A;功率(Pd):104W;导通电阻(RDS(on)@Vgs,Id):2.4mΩ@10V,50A;阈值电压(Vgs(th)@Id):3.9V@100uA;; LCSC Part Name: N沟道 耐压:40V 电流:85A; Supplier Part: C67862; Manufacturer: Infineon(英飞凌); Supplier Footprint: PQFN(5x6); JLCPCB Part Class: 扩展库; Datasheet: https://atta.szlcsc.com/upload/public/pdf/source/20190419/C386359_273C98C00830BF5419F9D4766EDDF693.pdf; Supplier: LCSC; Type: N沟道; Drain Source Voltage (Vdss): 40V; Continuous Drain Current (Id): 85A; Power Dissipation (Pd): 104W; Drain Source On Resistance (RDS(on)@Vgs,Id): 2.4mΩ@10V,50A; Gate Threshold Voltage (Vgs(th)@Id): 3.9V@100uA; Total Gate Charge (Qg@Vgs): 138nC@10V; Input Capacitance (Ciss@Vds): 4.574nF@25V; Operating Temperature: -55℃~+150℃@(Tj)
R126-R132 R135 R182-R185 R205 R206 R226-R229 R234-R237 = Res_0603: Supplier Footprint: 0603
R186 R187 = 0402WGF1002TCE: 电阻类型:厚膜电阻;阻值:10kΩ;精度:±1%;功率:62.5mW;最大工作电压:50V;温度系数:±100ppm/℃;; LCSC Part Name: 10kΩ ±1% 62.5mW 厚膜电阻; Supplier Part: C25744; Manufacturer: UNI-ROYAL(厚声); Supplier Footprint: 0402; JLCPCB Part Class: 基础库; Datasheet: https://atta.szlcsc.com/upload/public/pdf/source/20200306/C422600_1E6D84923E4A46A82E41ADD87F860B5C.pdf; Supplier: LCSC; Type: 厚膜电阻; Tolerance: ±1%; Power(Watts): 62.5mW; Overload Voltage (Max): 50V; Temperature Coefficient: ±100ppm/℃; Operating Temperature Range: -55℃~+155℃
R188 = 0402WGF1001TCE: 电阻类型:厚膜电阻;阻值:1kΩ;精度:±1%;功率:62.5mW;最大工作电压:50V;温度系数:±100ppm/℃;; LCSC Part Name: 1kΩ ±1% 62.5mW 厚膜电阻; Supplier Part: C11702; Manufacturer: UNI-ROYAL(厚声); Supplier Footprint: 0402; JLCPCB Part Class: 基础库; Datasheet: https://atta.szlcsc.com/upload/public/pdf/source/20200306/C422600_1E6D84923E4A46A82E41ADD87F860B5C.pdf; Supplier: LCSC; Type: 厚膜电阻; Tolerance: ±1%; Power(Watts): 62.5mW; Overload Voltage (Max): 50V; Temperature Coefficient: ±100ppm/℃; Operating Temperature Range: -55℃~+155℃
R189 = 0402WGF3302TCE: 电阻类型:厚膜电阻;阻值:33kΩ;精度:±1%;功率:62.5mW;最大工作电压:50V;温度系数:±100ppm/℃;; LCSC Part Name: 33kΩ ±1% 62.5mW 厚膜电阻; Supplier Part: C25779; Manufacturer: UNI-ROYAL(厚声); Supplier Footprint: 0402; JLCPCB Part Class: 基础库; Datasheet: https://atta.szlcsc.com/upload/public/pdf/source/20200306/C422600_1E6D84923E4A46A82E41ADD87F860B5C.pdf; Supplier: LCSC; Type: 厚膜电阻; Tolerance: ±1%; Power(Watts): 62.5mW; Overload Voltage (Max): 50V; Temperature Coefficient: ±100ppm/℃; Operating Temperature Range: -55℃~+155℃
R190-R193 R222-R225 R230-R233 = 0603WAF1002T5E: 电阻类型:厚膜电阻;阻值:10kΩ;精度:±1%;功率:100mW;最大工作电压:75V;温度系数:±100ppm/℃;; LCSC Part Name: 厚膜电阻 10kΩ ±1% 100mW; Supplier Part: C25804; Manufacturer: UNI-ROYAL(厚声); Supplier Footprint: 0603; JLCPCB Part Class: 基础库; Datasheet: https://atta.szlcsc.com/upload/public/pdf/source/20200306/C422600_1E6D84923E4A46A82E41ADD87F860B5C.pdf; Supplier: LCSC; Type: 厚膜电阻; Tolerance: ±1%; Power(Watts): 100mW; Overload Voltage (Max): 75V; Temperature Coefficient: ±100ppm/℃; Operating Temperature Range: -55℃~+155℃
SW5 = MSK12C02: 电路结构:单刀双掷;安装方式:卧贴;开关颜色:-;额定电流(DC):50mA;额定电压(DC):12V;额定电流(AC):-;额定电压(AC):-;机械寿命:1万次;; LCSC Part Name: 两档侧拨贴片 7脚 滑动开关; Supplier Part: C431540; Manufacturer: SHOU HAN(首韩); Supplier Footprint: SMD; JLCPCB Part Class: 扩展库; Datasheet: https://atta.szlcsc.com/upload/public/pdf/source/20190925/C431540_89155AEF0758B9AD1B2D805F83FB12E3.pdf; Supplier: LCSC; Circuit: 单刀双掷; Pin Style: SMD接片; Switch Length: 8mm; Switch Width: 2.8mm; Switch Height: 1.4mm; Mounting Style: 卧贴; Current Rating (DC): 50mA; Voltage Rating (DC): 12V; Mechanical Life: 1万次; Operating Temperature: -20℃~+70℃
U47 = LR8341A-T33: 输出类型:固定;最大输入电压:40V;输出电压:3.3V;最大输出电流:100mA;电源纹波抑制比(PSRR):55dB@(1kHz);输出极性:正极;; LCSC Part Name: 输入40V 输出3.3V 100mA; Supplier Part: C2829465; Manufacturer: LR(朗瑞); Supplier Footprint: SOT-23-3L; JLCPCB Part Class: 扩展库; Datasheet: https://atta.szlcsc.com/upload/public/pdf/source/20210426/C2829465_61F15D7ACE9671B48D4F69A8092B0D8F.pdf; Supplier: LCSC; Output Type: 固定; Maximum Input Voltage: 40V; Output Voltage: 3.3V; MAX Output Current: 100mA; Power Supply Rejection Ratio (PSRR): 55dB@(1kHz); standby current: 2uA; Operating Temperature: -40℃~+85℃; Output Polarity: 正极; Number of Outputs: 1
U48 U55 U56 = SN74HC125PWR: 输入类型:-;电源电压:2V~6V;元件数:4;每个元件位数:1;灌电流(IOL):7.8mA;拉电流(IOH):7.8mA;; Supplier Part: C132994; Manufacturer: TI(德州仪器); Supplier Footprint: TSSOP-14; JLCPCB Part Class: Extended Part; Datasheet: https://www.ti.com/cn/lit/gpn/sn74hc125; Supplier: LCSC; output type: 三态; Supply Voltage: 2V~6V; Number of Elements: 4; Number of Bits per Element: 1; Sink Current: 7.8mA; Source Current: 7.8mA; Logic Family: 74HC; Operating Temperature: -40℃~+85℃
U49 = FRM121WFR010TM: 电阻类型:采样电阻;阻值:10mΩ;精度:±1%;额定压降:-;功率:1W;温度系数:±50ppm/℃;安装方式:-;; LCSC Part Name: 10mΩ ±1% 1W; Supplier Part: C7467248; Manufacturer: FOJAN(富捷); Supplier Footprint: 1206; JLCPCB Part Class: 扩展库; Datasheet: https://atta.szlcsc.com/upload/public/pdf/source/20240709/7FCE84187288C94C67B1004F90EDDF14.pdf; Supplier: LCSC; Type: 采样电阻; Tolerance: ±1%; Power(Watts): 1W; Temperature Coefficient: ±50ppm/℃
U50 = DRV8701ERGER: DRV8701 47V H 桥智能栅极驱动器; LCSC Part Name: 有刷直流电机驱动芯片 45V; Supplier Part: C90964; Manufacturer: TI(德州仪器); Supplier Footprint: VQFN-24-EP(4x4); JLCPCB Part Class: 扩展库; Datasheet: https://www.ti.com/cn/lit/gpn/drv8701; Supplier: LCSC
U51 = INA240A2PWR: 放大器数:单路;; Supplier Part: C129949; Manufacturer: TI(德州仪器); Supplier Footprint: TSSOP-8; JLCPCB Part Class: 扩展库; Datasheet: https://www.ti.com/cn/lit/gpn/ina240; Supplier: LCSC; Number of Channels: 单路; Supply Current: 1.8mA; Operating Temperature: -40℃~+125℃
C86 = CL10B473KB8NNNC: 容值:47nF;精度:±10%;额定电压:50V;材质(温度系数):X7R;; LCSC Part Name: 47nF ±10% 50V; Supplier Part: C1622; Manufacturer: SAMSUNG(三星); Supplier Footprint: 0603; JLCPCB Part Class: 基础库; Datasheet: https://atta.szlcsc.com/upload/public/pdf/source/20160218/1457707763339.pdf; Supplier: LCSC; Tolerance: ±10%; Voltage Rated: 50V; Temperature Coefficient: X7R
CN16 CN17 = XT30(2+2)PB-M.G.B: LCSC Part Name: XT30PB(2+2)功率数据混合插头公金黑PCB直插; Supplier Part: C19268029; Manufacturer: AMASS(艾迈斯); JLCPCB Part Class: 扩展库; Datasheet: https://atta.szlcsc.com/upload/public/pdf/source/20240112/EA39AAAE8FEC10464B997A9AF1F68E09.pdf; Supplier: LCSC
H1 = X6521WVS-2x02H-C60D74: 插针结构:2x2P;间距:2.54mm;行距:2.54mm;圆针/方针:方针;安装类型:-;排数:双排;总PIN位数:4P;额定电流:3A;额定电压:250V;配合针长度:-;塑高:2.5mm;端接针长度:-;触头材质:黄铜;触头镀层:金;工作温度范围:-40℃~+105℃;焊接温度(最大值):260℃;颜色:黑色;; LCSC Part Name: 2x2P 间距:2.54mm 方针; Supplier Part: C780055; Manufacturer: XKB Connection(中国星坤); Supplier Footprint: SMD,P=2.54mm; JLCPCB Part Class: 扩展库; Datasheet: https://atta.szlcsc.com/upload/public/pdf/source/20211009/E3239EE5247E6BAFECB8B74A4FCF9AB8.pdf; Supplier: LCSC; Pin Structure: 2x2P; Pitch: 2.54mm; Row Spacing: 2.54mm; Circluar Pins/Square Pins: 方针; Number of Rows: 双排; Number of Pins: 4P; Current Rating (Max): 3A; Voltage Rating (Max): 250V; Insulation Height: 2.5mm; Contact Material: 黄铜; Contact Plating: 金; Operating Temperature Range: -40℃~+105℃; Soldering Temperature(Max): 260℃; Color: 黑色
H2 = X6521WVS-2x04H-C60D74: 插针结构:2x4P;间距:2.54mm;行距:2.54mm;圆针/方针:方针;安装类型:-;排数:双排;总PIN位数:8P;额定电流:3A;额定电压:250V;配合针长度:-;塑高:2.5mm;端接针长度:-;触头材质:黄铜;触头镀层:金;工作温度范围:-40℃~+105℃;焊接温度(最大值):260℃;颜色:黑色;; LCSC Part Name: 2x4P 间距:2.54mm 方针; Supplier Part: C780053; Manufacturer: XKB Connection(中国星坤); Supplier Footprint: SMD,P=2.54mm; JLCPCB Part Class: 扩展库; Datasheet: https://atta.szlcsc.com/upload/public/pdf/source/20211009/E3239EE5247E6BAFECB8B74A4FCF9AB8.pdf; Supplier: LCSC; Pin Structure: 2x4P; Pitch: 2.54mm; Row Spacing: 2.54mm; Circluar Pins/Square Pins: 方针; Number of Rows: 双排; Number of Pins: 8P; Current Rating (Max): 3A; Voltage Rating (Max): 250V; Insulation Height: 2.5mm; Contact Material: 黄铜; Contact Plating: 金; Operating Temperature Range: -40℃~+105℃; Soldering Temperature(Max): 260℃; Color: 黑色
H4 H5 = PM254V-11-06-H85: 插孔结构:1x6P;间距:2.54mm;行距:-;圆孔/方孔:方孔;安装类型:直插;排数:单排;总孔位数:6P;额定电流:3A;额定电压:250V;插孔方向:顶部;塑高:-;工作温度范围:-40℃~+105℃;; LCSC Part Name: 间距:2.54mm 1x6P 直插; Supplier Part: C2832269; Manufacturer: XFCN(兴飞); Supplier Footprint: 插件,P=2.54mm; JLCPCB Part Class: 扩展库; Datasheet: https://atta.szlcsc.com/upload/public/pdf/source/20210514/C2832269_B3EC97736B37C2783BDCE3050AA57447.pdf; Supplier: LCSC; Holes Structure: 1x6P; Pitch: 2.54mm; Circular Hole / Square Hole: 方孔; Mounting Type: 直插; Number of Rows: 单排; Number of Holes: 6P; Current Rating (Max): 3A; Voltage Rating (Max): 250V; Holes Direction: 顶部; Operating Temperature Range: -40℃~+105℃
R133 R134 = RTT0360R0FTP: 电阻类型:厚膜电阻;阻值:60Ω;精度:±1%;功率:100mW;最大工作电压:75V;温度系数:±100ppm/℃;; LCSC Part Name: 厚膜电阻 60Ω ±1% 100mW; Supplier Part: C166918; Manufacturer: RALEC(旺诠); Supplier Footprint: 0603; JLCPCB Part Class: 扩展库; Datasheet: https://atta.szlcsc.com/upload/public/pdf/source/20180928/C303758_52AE496EA05AD4D633595C32F5A0EBAF.pdf; Supplier: LCSC; Type: 厚膜电阻; Tolerance: ±1%; Power(Watts): 100mW; Overload Voltage (Max): 75V; Temperature Coefficient: ±100ppm/℃; Operating Temperature Range: -55℃~+155℃
U31 = TJA1050T/CM,118: 类型:收发器;; LCSC Part Name: 4.75V~5.25V; Supplier Part: C6952; Manufacturer: NXP(恩智浦); Supplier Footprint: SOP-8; JLCPCB Part Class: 扩展库; Datasheet: https://atta.szlcsc.com/upload/public/pdf/source/20140411/1457707042917.pdf; Supplier: LCSC; Type: 收发器; Supply Voltage: 4.75V~5.25V; Supply Current: 50mA
U54 = DR-9F: Supplier Part: C3020657; Manufacturer: ZHOURI(洲日); Supplier Footprint: 插件; JLCPCB Part Class: 扩展库; Datasheet: https://atta.szlcsc.com/upload/public/pdf/source/20220825/89AE8243734ACCF7AC001F17B5FFD647.pdf; Supplier: LCSC
无线数传电源 = XT30UPB-F30.G.Y: 类别:-;类型1:-;; LCSC Part Name: AMASS(艾迈斯)直立焊板式连接器XT30UPB30-F.G.*; Supplier Part: C108769; Manufacturer: AMASS(艾迈斯); JLCPCB Part Class: 扩展库; Datasheet: https://atta.szlcsc.com/upload/public/pdf/source/20220715/AFD68B9E8B6CA95A7295DBF4AF9325E4.pdf; Supplier: LCSC; Brand: 艾迈斯; Type: 航模插头; Colour: 黄色; RatedVoltage: DC 500V; InterfaceType: 母头; MetalMaterial: 镀金; InsulationMaterial: PA; RatedCurrent: 15A; contact resistance: 0.65mΩ
CN2 = APCI0078-P002A_C7498136: 连接器类型:M.2;间距:0.5mm;引脚总数:67P;安装方式:卧贴;工作温度范围:-55℃~+105℃;; LCSC Part Name: M.2(NGFF)连接器67PIN KEY-B型 H3.2MM（可配螺柱）; Supplier Part: C7498136; Manufacturer: LX(连欣科技); Supplier Footprint: SMD,P=0.5mm,卧贴; JLCPCB Part Class: 扩展库; Datasheet: https://atta.szlcsc.com/upload/public/pdf/source/20230918/968CC5EFA479112182B1AF662CC27BAA.pdf; Supplier: LCSC; Connector Type: M.2; Pitch: 0.5mm; Number of Pins: 67P; Mounting Style: 卧贴; Height Above Board: 3.2mm; Contact Material: 铜; Contact Plating: 金; Operating Temperature Range: -55℃~+105℃
D1 = 1N5819WS_C191023: 正向压降(Vf):600mV@1A;直流反向耐压(Vr):40V;平均整流电流(Io):1A;; LCSC Part Name: 电压:40V 电流:1A; Supplier Part: C191023; Manufacturer: Hottech(合科泰); Supplier Footprint: SOD-323; JLCPCB Part Class: 基础库; Datasheet: https://atta.szlcsc.com/upload/public/pdf/source/20220428/3CB86FD8D28D653594B4E35F9D5AEFD9.pdf; Supplier: LCSC; Forward Voltage (Vf@If): 600mV@1A; Reverse Voltage (Vr): 40V; Average Rectified Current (Io): 1A
LINK1 USART1 = WAFER-GH1.25-4PWB: 插针结构:1x4P;间距:1.25mm;安装方式:卧贴;参考系列:GH;总PIN数:4P;排数:1;每排PIN数:4;额定电流:1A;工作温度范围:-25℃~+85℃;; LCSC Part Name: 1x4P 间距:1.25mm 卧贴 系列:GH; Supplier Part: C3029379; Manufacturer: XUNPU(讯普); Supplier Footprint: SMD,P=1.25mm,卧贴; JLCPCB Part Class: 扩展库; Datasheet: https://atta.szlcsc.com/upload/public/pdf/source/20220527/CB8773BFB0913C3B8ABD62CB38BA101A.pdf; Supplier: LCSC; Pins Structure: 1x4P; Pitch: 1.25mm; Mounting Style: 卧贴; Reference Series: GH; Number of Pins: 4P; Number of Rows: 1; Number of PINs Per Row: 4; Current Rating (Max): 1A; Operating Temperature Range: -25℃~+85℃
OLED1 = IPCP254M08PB08S: 间距:2.54mm;安装类型:立贴;排数:单排;总PIN位数:8P;塑高:2.5mm;触头材质:黄铜;工作温度范围:-40℃~+105℃;颜色:黑色;; LCSC Part Name: 间距:2.54mm 立贴; Supplier Part: C22438432; Manufacturer: INCP; Supplier Footprint: SMD,P=2.54mm(交错脚); Datasheet: https://atta.szlcsc.com/upload/public/pdf/source/20240523/B4FE6A2C412EE3021DC2B129EE5E4118.pdf; Supplier: LCSC; Pitch: 2.54mm; Mounting Type: 立贴; Number of Rows: 单排; Number of Pins: 8P; Insulation Height: 2.5mm; Contact Material: 黄铜; Operating Temperature Range: -40℃~+105℃; Color: 黑色
R139 = 0603WAF5101T5E: 电阻类型:厚膜电阻;阻值:5.1kΩ;精度:±1%;功率:100mW;最大工作电压:75V;温度系数:±100ppm/℃;; LCSC Part Name: 5.1kΩ ±1% 100mW 厚膜电阻; Supplier Part: C23186; Manufacturer: UNI-ROYAL(厚声); Supplier Footprint: 0603; JLCPCB Part Class: 基础库; Datasheet: https://atta.szlcsc.com/upload/public/pdf/source/20200306/C422600_1E6D84923E4A46A82E41ADD87F860B5C.pdf; Supplier: LCSC; Type: 厚膜电阻; Tolerance: ±1%; Power(Watts): 100mW; Overload Voltage (Max): 75V; Temperature Coefficient: ±100ppm/℃; Operating Temperature Range: -55℃~+155℃
U8 = CH340K_C18208922: LCSC Part Name: CH340K 人工转编带; Supplier Part: C18208922; Manufacturer: WCH(南京沁恒); Supplier Footprint: ESSOP-10-150mil-1mm; JLCPCB Part Class: 扩展库; Datasheet: https://atta.szlcsc.com/upload/public/pdf/source/20240313/9D833A30DDFD16C064A7ADE10A944019.pdf; Supplier: LCSC
U33 U34 = FRC0603J471 TS: 电阻类型:厚膜电阻;阻值:470Ω;精度:±5%;功率:100mW;最大工作电压:75V;温度系数:±100ppm/℃;; LCSC Part Name: 470Ω ±5% 100mW 厚膜电阻; Supplier Part: C2907172; Manufacturer: FOJAN(富捷); Supplier Footprint: 0603; JLCPCB Part Class: 扩展库; Datasheet: https://atta.szlcsc.com/upload/public/pdf/source/20211221/925EC7D7225764EE0046F22065062C87.pdf; Supplier: LCSC; Type: 厚膜电阻; Tolerance: ±5%; Power(Watts): 100mW; Overload Voltage (Max): 75V; Temperature Coefficient: ±100ppm/℃; Operating Temperature Range: -55℃~+155℃
USB1 = TYPE-C 16PIN 2MD(073): 连接器类型:Type-C;标准:-;公母:母;端口数量:1;触点数量:16P;安装方式:卧贴;额定电流 - 电源:5A;工作温度范围:-25℃~+85℃;; LCSC Part Name: Type-C 母 卧贴; Supplier Part: C2765186; Manufacturer: SHOU HAN(首韩); Supplier Footprint: SMD; JLCPCB Part Class: 扩展库; Datasheet: https://atta.szlcsc.com/upload/public/pdf/source/20211123/39B17C16241EAC15C5E277BDA434118E.pdf; Supplier: LCSC; Connector Type: Type-C; Gender: 母; Number of Ports: 1; Number of Contacts: 16P; Mounting Style: 卧贴; Current Rating - Power (Max): 5A; Operating Temperature Range: -25℃~+85℃
C78 C84 = RVT100UF35V67RV0034: 容值:100uF;精度:±20%;额定电压:35V;纹波电流:87mA@120kHz;等效串联电阻:-;; LCSC Part Name: 100uF ±20% 35V; Supplier Part: C2836442; Manufacturer: KNSCHA(科尼盛); Supplier Footprint: SMD,D6.3xL7.7mm; JLCPCB Part Class: 扩展库; Datasheet: https://atta.szlcsc.com/upload/public/pdf/source/20210528/C2836442_7F6389BF36F63F32D6DF3A507E8E95D6.pdf; Supplier: LCSC; Tolerance: ±20%; Rated Voltage: 35V; Ripple Current: 87mA@120kHz; φD: 6.3mm; L: 7.7mm; Lifetime @ Temp: 2000hrs@105℃; Operating Temperature: -55℃~+105℃
C88 C89 = CGA0805X5R226M350MT: 容值:22uF;精度:±20%;额定电压:35V;材质(温度系数):X5R;; LCSC Part Name: 22uF ±20% 35V; Supplier Part: C6119901; Manufacturer: HRE(芯声); Supplier Footprint: 0805; JLCPCB Part Class: 扩展库; Datasheet: https://atta.szlcsc.com/upload/public/pdf/source/20231129/D589D0CC4D260F7AC3A77E53B455CCB3.pdf; Supplier: LCSC; Tolerance: ±20%; Voltage Rated: 35V; Temperature Coefficient: X5R
C90 C91 = CL21A106KPFNNNE: 容值:10uF;精度:±10%;额定电压:10V;材质(温度系数):X5R;; LCSC Part Name: 10uF ±10% 10V; Supplier Part: C17024; Manufacturer: SAMSUNG(三星); Supplier Footprint: 0805; JLCPCB Part Class: 扩展库; Datasheet: https://atta.szlcsc.com/upload/public/pdf/source/20160218/1457707763339.pdf; Supplier: LCSC; Tolerance: ±10%; Voltage Rated: 10V; Temperature Coefficient: X5R
D2 = BZT52C16_C727007: 二极管配置:独立式;稳压值(标称值):16V;稳压值(范围):15.3V~17.1V;功率:500mW;精度:-;; Supplier Part: C727007; Manufacturer: TWGMC(台湾迪嘉); Supplier Footprint: SOD-123; JLCPCB Part Class: 扩展库; Datasheet: https://atta.szlcsc.com/upload/public/pdf/source/20200828/C727006_A23CB424A23C0F54CFF10A724B844049.pdf; Supplier: LCSC; Diode Configuration: 独立式; Zener Voltage (Nom): 16V; Reverse Leakage Current (Ir): 100nA@11.2V; Zener Voltage (Range): 15.3V~17.1V; Power Dissipation: 500mW; Zener Impedance (Zzt): 40Ω
D24 D25 = SS54_C22452: 二极管配置:独立式;正向压降(Vf):550mV@5A;直流反向耐压(Vr):40V;整流电流:5A;; LCSC Part Name: 电压:40V 电流:5A; Supplier Part: C22452; Manufacturer: MDD(辰达半导体); Supplier Footprint: SMA(DO-214AC); JLCPCB Part Class: 基础库; Datasheet: https://atta.szlcsc.com/upload/public/pdf/source/20230314/529CD85F9B31F69841D3A079BC07E377.pdf; Supplier: LCSC; Diode Configuration: 独立式; Forward Voltage (Vf@If): 550mV@5A; Reverse Voltage (Vr): 40V; Rectified Current: 5A; Reverse Leakage Current (Ir): 1mA@40V
L4 = JSHC0630H-150M-G: Supplier: LCSC; Supplier Part: C334085; Manufacturer: Jinlai
L5 = FTC252012S2R2MBCA: 电感值:2.2uH;精度:±20%;额定电流:3A;饱和电流(Isat):3.8A;类型:一体成型电感;; LCSC Part Name: 2.2uH ±20% 3.8A; Supplier Part: C5832372; Manufacturer: cjiang(长江微电); Supplier Footprint: 1008; JLCPCB Part Class: 扩展库; Datasheet: https://atta.szlcsc.com/upload/public/pdf/source/20230602/8FFEDA9C0247A92A0D4B67554BFE4091.pdf; Supplier: LCSC; Tolerance: ±20%; Rated Current: 3A; Saturation Current (Isat): 3.8A; DC Resistance (DCR): 55mΩ; Type: 一体成型电感
Q11 = TPH1R403NL: Supplier: LCSC; Manufacturer: TOSHIBA; Supplier Part: C83440; JLCPCB Part Class: Extend; JLCPCB SMD: Yes
R136-R138 = FRC0603J103TS: 电阻类型:厚膜电阻;阻值:10kΩ;精度:±5%;功率:100mW;最大工作电压:75V;温度系数:±100ppm/℃;; LCSC Part Name: 10kΩ ±5% 100mW 厚膜电阻; Supplier Part: C2930027; Manufacturer: FOJAN(富捷); Supplier Footprint: 0603; JLCPCB Part Class: 扩展库; Datasheet: https://atta.szlcsc.com/upload/public/pdf/source/20211221/925EC7D7225764EE0046F22065062C87.pdf; Supplier: LCSC; Type: 厚膜电阻; Tolerance: ±5%; Power(Watts): 100mW; Overload Voltage (Max): 75V; Temperature Coefficient: ±100ppm/℃; Operating Temperature Range: -55℃~+155℃
SW1 = SS-3235S-L3: 电路结构:双刀双掷;安装方式:立贴;开关颜色:黑色;额定电流(DC):50mA;额定电压(DC):12V;额定电流(AC):50mA;额定电压(AC):12V;机械寿命:1万次;; LCSC Part Name: 柄长4mm 立贴双档 滑动开关; Supplier Part: C381098; Manufacturer: XKB Connectivity(中国星坤); Supplier Footprint: SMD; JLCPCB Part Class: 扩展库; Datasheet: https://atta.szlcsc.com/upload/public/pdf/source/20200227/C381098_2A18B7660478ED4C962829E19BCD5514.pdf; Supplier: LCSC; Circuit: 双刀双掷; Actuator Style: 矩形柱状; Pin Style: SMD接片; Switch Length: 9.1mm; Switch Width: 3.55mm; Switch Height: 6.6mm; Mounting Style: 立贴; Actuator Color: 黑色; Current Rating (DC): 50mA; Voltage Rating (DC): 12V; Current Rating (AC): 50mA; Voltage Rating (AC): 12V; Mechanical Life: 1万次; Operating Temperature: -40℃~+85℃
U27 = SP1N28STER: Supplier Part: C9900119712; Supplier Footprint: ESOP8L; Supplier: LCSC
U32 = TPS563201DDCR: 功能类型:降压型;输出类型:可调;输入电压:4.5V~17V;输出电压:768mV~7V;输出电流:3A;; Supplier Part: C116592; Manufacturer: TI(德州仪器); Supplier Footprint: SOT-23-THIN-6; JLCPCB Part Class: 扩展库; Datasheet: https://atta.szlcsc.com/upload/public/pdf/source/20230424/FEEFD13F14AFA838E4C009B2DDC1DFA0.pdf; Supplier: LCSC; Function: 降压型; Output Type: 可调; Input Voltage: 4.5V~17V; Output Voltage: 768mV~7V; Output Current: 3A; Switching Frequency: 580kHz; Operating Temperature: -40℃~+125℃@(TJ); Synchronous Rectification: 是; Number of Outputs: 1; Topology: 降压式; Switch tube (built-in/external): 内置
升压模块24vin1 电池12vin = XT30PW-F20.G.Y: 类别:-;类型1:-;; LCSC Part Name: AMASS(艾迈斯)电源连接器 母头 XT30PW-F; Supplier Part: C2913282; Manufacturer: AMASS(艾迈斯); JLCPCB Part Class: 扩展库; Datasheet: https://atta.szlcsc.com/upload/public/pdf/source/20231218/06CFCF98887A9A87638B0856A725C8FD.pdf; Supplier: LCSC; Type: 航模插头; InterfaceType: 母头
电池12out1 = XT30PW-M30.G.Y: 类别:-;类型1:-;; LCSC Part Name: AMASS(艾迈斯)航模插头 卧式弯脚 XT30PW-M公头; Supplier Part: C431092; Manufacturer: AMASS(艾迈斯); JLCPCB Part Class: 扩展库; Datasheet: https://atta.szlcsc.com/upload/public/pdf/source/20220222/6A9F22F7850E25B33E1BE430ADF8560B.pdf; Supplier: LCSC; Type: 航模插头; RatedVoltage: DC 500V; InterfaceType: 公头; RatedCurrent: 15A; RecommendedWireGauge: 16/18/20AWG; contact resistance: 1.2mΩ; specifications: 2pin

## Nets
AVDD_1: C153.2 R188.1 U50.6(VREF) U50.7(AVDD)
DVDD_1: C154.2 C156.2 R186.1 R187.1 U48.14(VCC) U50.8(DVDD)
GND_BAT: C78.2 C79.1 C80.1 C82.1 C83.2 C84.2 C88.1 C89.1 C90.2 C91.2 C92.2 C94.1 C95.1 C96.1 C97.1 C98.1 C119.1 C133.1 C134.1 C143.1 C144.1 C150.1 C153.1 C154.1 C156.1 CN16.3 CN17.3 LED6.1(K) LED7.1(K) LED8.1(K) LED9.1(K) R126.1 R129.1 R132.1 R137.1 R189.1 R190.1 R191.1 R192.1 R193.1 R196.1 R213.1 R214.1 R215.1 U27.7(GND) U27.9(EP) U32.1(GND) U47.1(VSS) U48.1(1OE#) U48.4(2OE#) U48.7(GND) U48.10(3OE#) U48.13(4OE#) U49.2 U50.5(GND) U50.16(GND) U50.20(SN) U50.25(EP) U51.3(IN-) 升压模块24vin1.2 无线数传电源.2(-) 电池12out1.1(-) 电池12vin.2
GND_PRO: C85.2 C86.2 C93.1 C166.2 C167.2 CN2.3 CN2.11 CN2.33 CN2.45 CN2.57 CN2.73 CN2.76 CN2.77 CN5.13 CN5.23 D32.1 D33.1 D34.1 D35.1 D36.1 D37.1 D38.1 H2.3 H2.7 H4.6 H5.6 J1.1 J2.1 J3.1 J4.1 LINK1.1 OLED1.1 R139.2 R195.1 R196.2 R198.1 R200.1 R212.1 R213.2 R214.2 R215.2 R217.1 R219.1 R221.1 R222.1 R223.1 R224.1 R225.1 R230.1 R231.1 R232.1 R233.1 U8.3(GND) U8.11(GND) U31.2(GND) U31.8(S) U51.1(NC) U51.7(REF1) U54.5 U55.1(1OE#) U55.4(2OE#) U55.7(GND) U55.10(3OE#) U55.13(4OE#) U56.1(1OE#) U56.4(2OE#) U56.7(GND) U56.10(3OE#) U56.13(4OE#) USART1.4 USB1.1(GND) USB1.12(GND) USB1.13(SHELL) USB1.14(SHELL)
VCC_+3V3: C88.2 C89.2 C93.2 C144.2 C155.1 C158.2 C160.2 C161.2 C162.2 C163.2 C164.2 C165.2 C166.1 C167.1 CN5.18 H2.8 L5.1 LINK1.4 OLED1.2 R135.2 R138.1 R182.2 SW5.2 SW9.2 SW11.2 SW12.2 SW13.2 SW14.2 SW15.2 SW16.2 U8.7(VCC) U8.10(V3) U47.2(VOUT) U51.5(VS) U51.6(REF2) U55.14(VCC) U56.14(VCC)
VCC_+5V: C85.1 C90.1 C91.1 C92.1 CN2.2 CN2.4 CN2.6 CN2.8 D1.1(K) D25.2(K) H4.3 H5.3 R127.2 R130.2 R136.1 U31.3(VCC) U32.3(VIN) USART1.1
VCC_+12V: D2.1(K) Q11.1(S) Q11.2(S) Q11.3(S) SW1.3 SW1.6 无线数传电源.1(+) 电池12out1.2(+) 电池12vin.1
VCC_+24V: C143.2 CN16.4 CN17.4 D31.2(A) Q30.5(D) Q30.6(D) Q30.7(D) Q30.8(D) Q30.9(D) Q32.5(D) Q32.6(D) Q32.7(D) Q32.8(D) Q32.9(D) U47.3(VIN) 升压模块24vin1.1
VCC_BAT: C94.2 C95.2 C96.2 C97.2 C98.2 C119.2 C133.2 C134.2 D24.1(A) Q11.5(D)
VCC_USB: D1.2(A) USB1.2(VBUS) USB1.11(VBUS)
232R: H2.2 U54.3
232T: H2.1 U54.2
ADC1_IN0: CN2.30 CN5.12
ADC1_IN1: CN2.32
ADC1_IN2: CN2.34
ADC1_IN3: CN2.38
CAN1_RX: CN2.51 H5.5
CAN1_TX: CN2.49 H5.4
CAN2_RX: CN2.74 H4.5
CAN2_TX: CN2.72 H4.4
CAN_RX: U31.4(RXD)
CAN_TX: U31.1(TXD)
CANH: R133.2 U31.7(CANH)
CANL: R134.1 U31.6(CANL)
D+: U8.1(UD+) USB1.6(DP1) USB1.8(DP2)
D-: U8.2(UD-) USB1.5(DN2) USB1.7(DN1)
DATA_CANH: CN5.21 H1.2 H4.1
DATA_CANL: CN5.22 H1.4 H4.2
DEBUG_CLK: CN2.36 LINK1.2
DEBUG_DIO: CN2.47 LINK1.3
DEBUG_USART_RX: CN2.53 U34.2 USART1.2
DEBUG_USART_TX: CN2.55 U33.2 USART1.3
DIR_IO1: CN2.63 CN5.1
DIR_IO2: CN2.61 CN5.2
DOWNSHIFTSIGN_OUT: CN5.17 U56.6(2Y)
DOWNSIGN_IN: C158.1 CN5.16 D33.2 R198.2 R238.2 SW9.1
DTR: U8.4(DTR#)
EN-IN_1: R185.1 R190.2 U48.5(2A)
EN_1: U48.6(2Y) U50.14(EN)
ENCODER0: CN2.62
ENCODER1: CN2.60
ENCODER2: CN2.58
ENCODER3: CN2.7
ENCODER4: CN2.9
ENCODER5: CN2.5
ENIN_1: CN2.68 R185.2
GH1_1: Q32.4(G) U50.17(GH1)
GH2_1: Q30.4(G) U50.24(GH2)
GL1_1: Q33.4(G) U50.19(GL1)
GL2_1: Q31.4(G) U50.22(GL2)
I_OUT_R: U51.8(OUT)
IOOUT1: CN5.7 U48.8(3Y) U55.3(1Y)
IOOUT1_IN: R206.2
IOOUT2: CN5.8 U48.11(4Y) U55.6(2Y)
IOOUT2_IN: R205.2
IOOUT3: U55.8(3Y)
IOOUT4: U55.11(4Y)
MCU_DOWMSHIFTSIGN_OUT: CN2.21 R237.2
MCU_DOWNSIGN_IN: CN2.54 R238.1
MCU_IOOUT1: CN2.75 R228.2
MCU_IOOUT2: CN2.71 R229.2
MCU_IOOUT3: CN2.69 R227.2
MCU_IOOUT4: CN2.67 R226.2
MCU_SERVOPWM_1: CN2.44 R234.2
MCU_SERVOPWM_2: CN2.46 R235.2
MCU_UPSHIFTSIGN_IN: CN2.56 R194.1
MCU_UPSHIFTSIGN_OUT: CN2.23 R236.2
MOTO_CANH: CN16.2 CN17.2 H1.1 H5.1
MOTO_CANL: CN16.1 CN17.1 H1.3 H5.2
MOTOEN: R183.2 SW5.3 U50.13(nSLEEP)
PA4: CN2.40 R220.1
PA5: CN2.42 R218.1
PA8: CN2.59
PA15: CN2.43
PB0: CN2.52 R199.1
PB3: CN2.25
PB9: CN2.1
PB14: CN2.70 R184.2
PC0: CN2.22
PC1: CN2.24
PC2: CN2.26
PC3: CN2.28
PC4: CN2.48 R216.1
PC5: CN2.50 R211.1
PD0: CN2.41
PD1: CN2.39
PD3: CN2.37
PD4: CN2.35
PD5: CN2.31 H2.5
PD6: CN2.29 H2.6
PD7: CN2.27
PD8: CN2.66 CN5.3
PD9: CN2.64 CN5.4
PD15: CN2.65
PE3: CN2.10
PE6: CN2.20
PH-IN_1: R184.1 R191.2 U48.2(1A)
PH_1: U48.3(1Y) U50.15(PH)
RTS: U8.6(RTS#)
SCR_BLK: OLED1.8
SCR_CS: OLED1.7
SCR_DC: OLED1.6
SCR_RES: OLED1.5
SERVOPWM_1: CN5.6 U56.11(4Y)
SERVOPWM_2: CN5.5 U56.8(3Y)
SH1_1: CN14.2(+) Q32.1(S) Q32.2(S) Q32.3(S) Q33.5(D) Q33.6(D) Q33.7(D) Q33.8(D) Q33.9(D) U50.18(SH1)
SH2_1: CN14.1(-) Q30.1(S) Q30.2(S) Q30.3(S) Q31.5(D) Q31.6(D) Q31.7(D) Q31.8(D) Q31.9(D) U50.23(SH2)
SP_1: Q31.1(S) Q31.2(S) Q31.3(S) Q33.1(S) Q33.2(S) Q33.3(S) U49.1 U50.21(SP) U51.2(IN+)
SPI1_MOSI: OLED1.4
SPI1_SCK: OLED1.3
SWITCH1_IN: C161.1 CN5.20 D34.2 R199.2 R200.2 SW12.1
SWITCH2_IN: C162.1 CN5.19 D35.2 R211.2 R212.2 SW13.1
SWITCH3_IN: C163.1 CN5.11 D36.2 R216.2 R217.2 SW14.1
SWITCH4_IN: C164.1 CN5.10 D37.2 R218.2 R219.2 SW15.1
SWITCH5_IN: C165.1 CN5.9 D38.2 R220.2 R221.2 SW16.1
UPSHIFTSIGN_IN: C160.1 CN5.15 D32.2 R194.2 R195.2 SW11.1
UPSHIFTSIGN_OUT: CN5.14 U56.3(1Y)
$2N634: C83.1 R131.2
$2N635: R131.1 U27.6(COMP)
$2N636: C81.1 U27.1(BOOT)
$2N637: C82.2 C84.1 D25.1(A) L4.2
$2N639: R128.1 R129.2 U27.5(FB)
$2N640: C81.2 L4.1 U27.8(SW)
$2N641: LED6.2(A) R130.1
$2N642: R127.1 R128.2
$2N643: C78.1 C79.2 C80.2 D24.2(K) U27.2(VIN) U27.3(EN)
$2N644: R126.2 U27.4(RT/CLK)
$2N909: Q11.4(G) SW1.2 SW1.5
$2N910: D2.2(A) R132.2 SW1.1 SW1.4
$2N1574: C87.1 L5.2 U32.2(SW)
$2N1704: LED7.2(A) R135.1
$2N1742: C87.2 U32.6(VBST)
$2N1819: R136.2 U32.5(EN)
$2N1977: R137.2 R138.2 U32.4(VFB)
$3N17976: R223.2 R228.1 U55.2(1A)
$3N17982: R222.2 R229.1 U55.5(2A)
$3N18603: R231.2 R236.1 U56.2(1A)
$3N18609: R230.2 R237.1 U56.5(2A)
$3N20257: R232.2 R235.1 U56.9(3A)
$3N20268: R233.2 R234.1 U56.12(4A)
$3N20297: R224.2 R227.1 U55.9(3A)
$3N20302: R225.2 R226.1 U55.12(4A)
Net-(C86-1): C86.1 R133.1 R134.2 U31.5(VREF)
Net-(C150-2): C150.2 C151.1 D31.1(K) U50.1(VM)
Net-(C151-2): C151.2 U50.2(VCP)
Net-(C152-1): C152.1 U50.3(CPH)
Net-(C152-2): C152.2 U50.4(CPL)
Net-(C155-2): C155.2 U51.4(GND)
Net-(LED8-2): LED8.2(A) R182.1
Net-(LED9-2): LED9.2(A) R183.1
Net-(R139-1): R139.1 USB1.4(CC1) USB1.10(CC2)
Net-(R186-2): R186.2 U50.9(nFAULT)
Net-(R187-2): R187.2 U50.10(SNSOUT)
Net-(R188-2): R188.2 R189.2 U50.12(IDRIVE)
Net-(R192-2): R192.2 R206.1 U48.9(3A)
Net-(R193-2): R193.2 R205.1 U48.12(4A)
Net-(U8-8): U8.8(TXD) U34.1
Net-(U8-9): U8.9(RXD) U33.1

Not connected (* = marked no-connect by the designer): H2 4*; LINK1 5 6; SW5 1* 4; U8 5(CTS#)*; U50 11(SO)*; U54 1* 4* 6* 7* 8* 9* 10(MH1) 11(MH2); USART1 5 6; USB1 3(SBU2)* 9(SBU1)*; 升压模块24vin1 3 4; 电池12out1 3 4; 电池12vin 3 4

## Notes on the sheets
sheet 1
- 数据CAN
- 直流电机引脚
- 预留串口3
- 预留可能的编码器引脚
- （按键）升档按键
- 调试串口
- （按键）其他预留按键开关
- 电机CAN
- 原LINK2
- 舵机输出PWM
- （按键）其他预留按键开关
- 原LINK1
- ADC接口
- 数传电台串口
- UART
sheet 2
- 12v转5v
- 此处为pmos
- 开关防打火电路
- 开关电路
- 12v转3v3
sheet 3
- 驱动单片机接口
- 输入电源
- 保护电路
- 保护电路
- 保护电路
- 指示灯开关
- H桥驱动1
- H桥1
sheet 6
- 直连IO
- 预留串口
- 占空比输出
- IO输出
- 开关
